# Altium project Iris.PrjPCB (part 1 of 2)
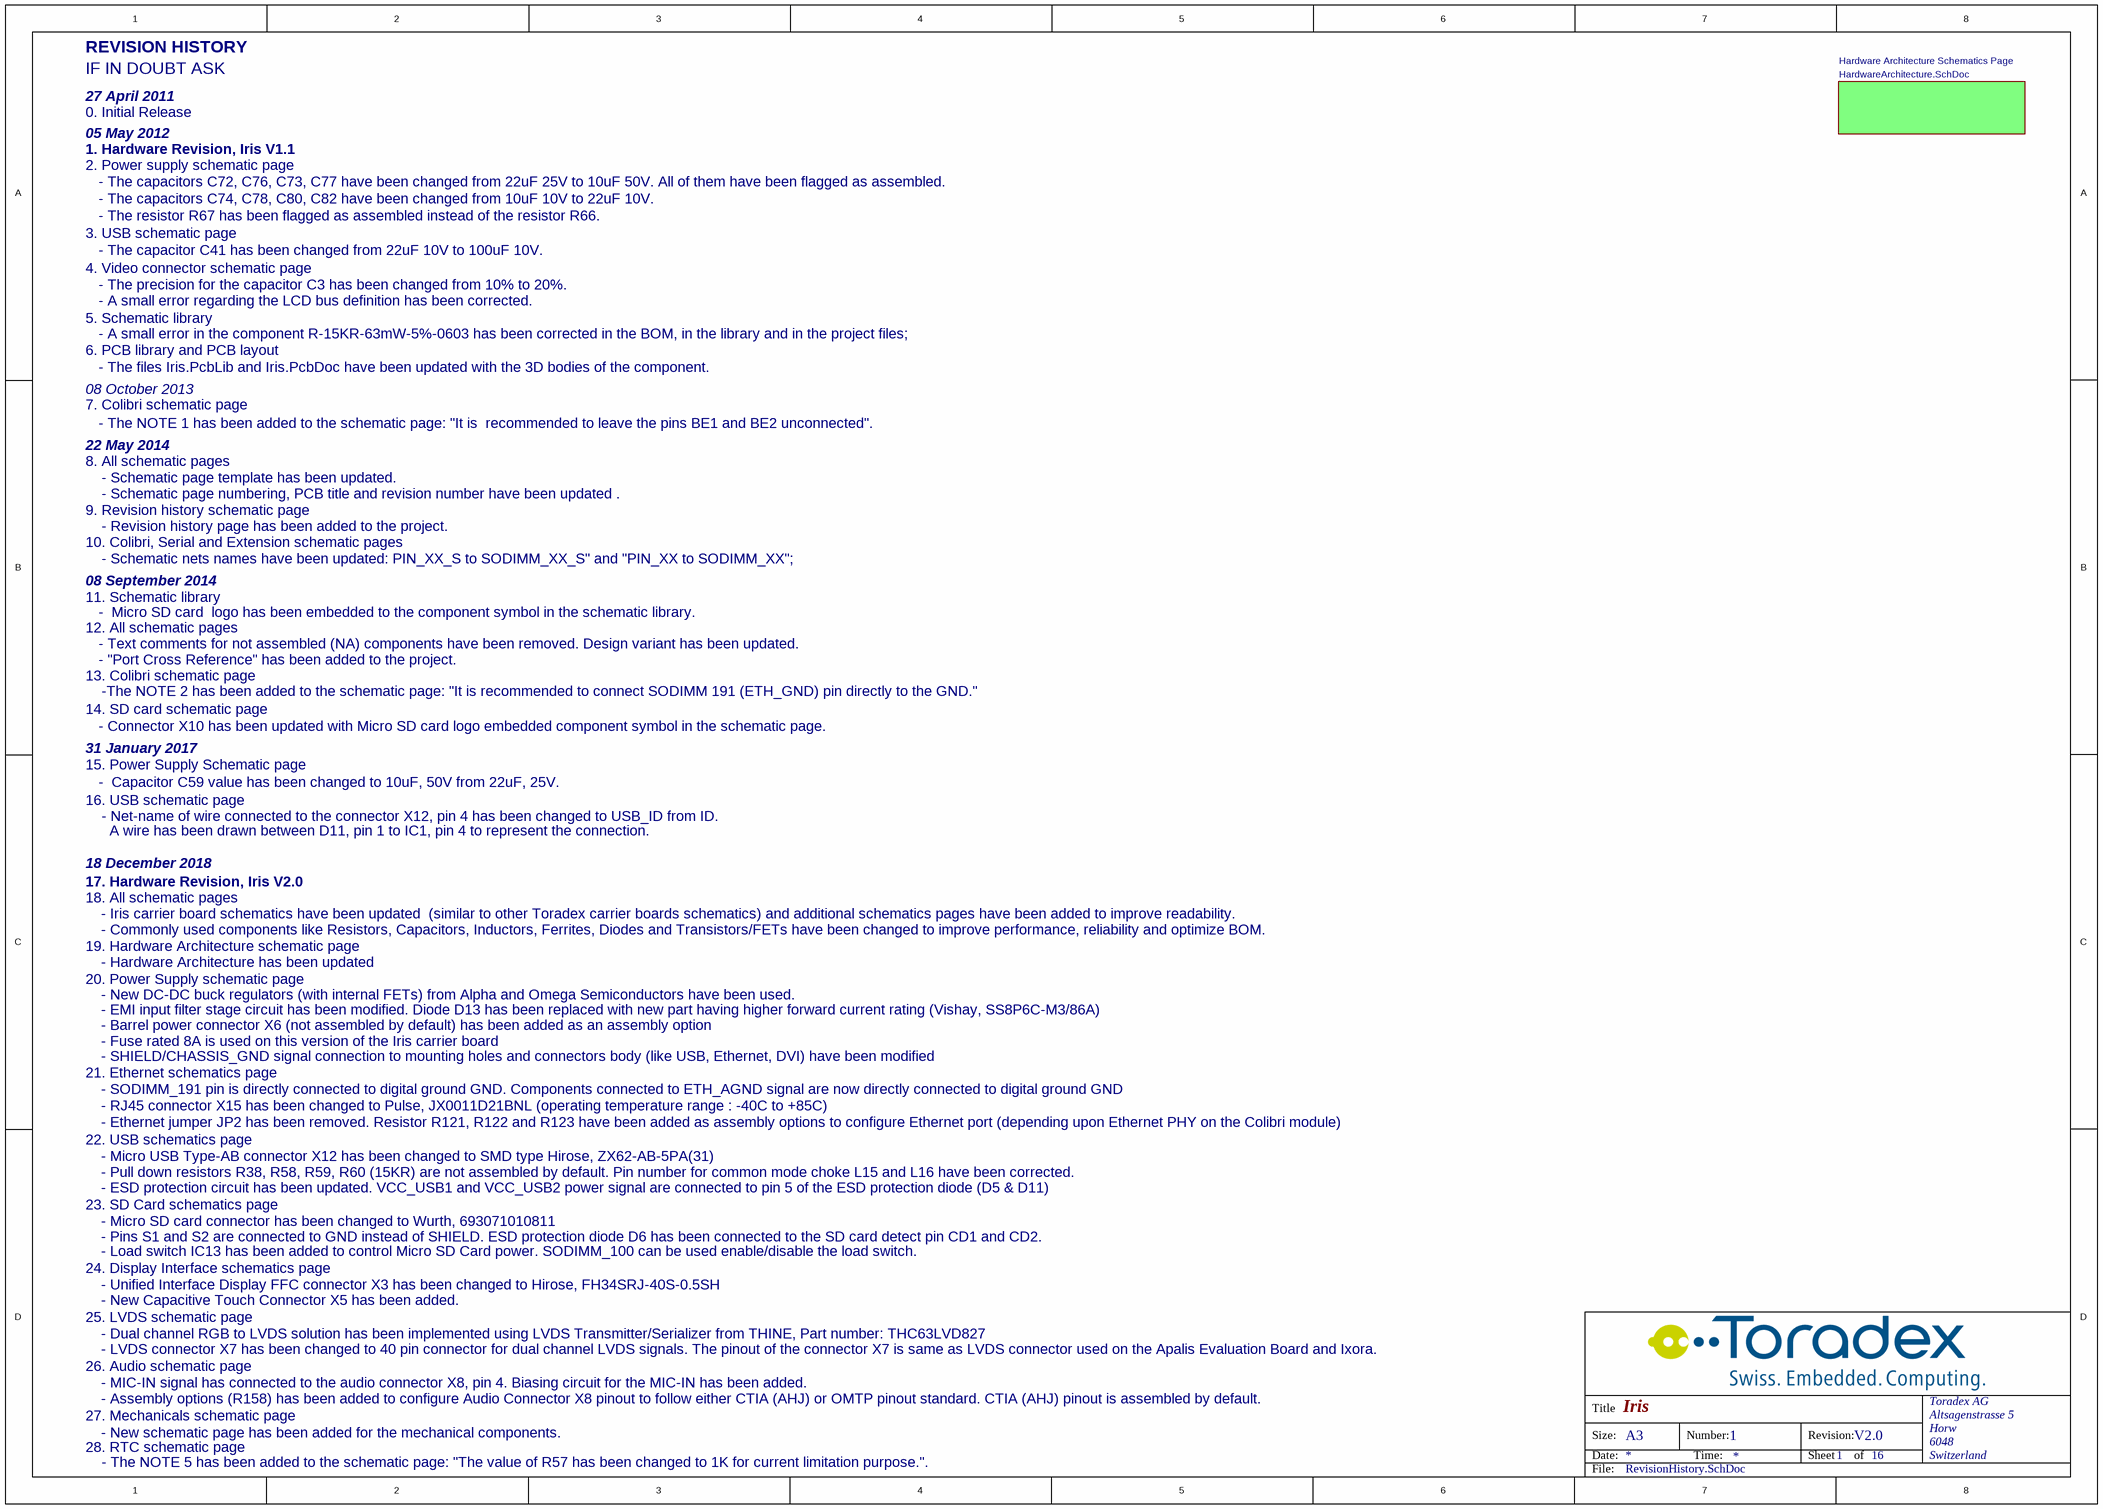
[diagram p0: RevisionHistory.SchDoc]
16 sheets, 400 parts. Net scope: global (net labels, ports and power ports of the same name join across sheets).
Board file: Iris.PcbDoc
Sheets:
  RevisionHistory.SchDoc
    Hardware Architecture Schematics Page = HardwareArchitecture.SchDoc
      Colibri Schematic Page = Colibri.SchDoc
      PowerSupply Schematic Page = PowerSupply.SchDoc
      Display Interface (RGB) Schematic Page = DisplayInterface.SchDoc
      Micro SDCard Schematic Page = SDCard.SchDoc
      Extension Schematic Page = Extension.SCHDOC
      Ethernet Schematic Page = Ethernet.SchDoc
      Audio Schematic Page = Audio.SchDoc
      USB Schematic Page = USB.SchDoc
      Serial Schematic Page = Serial.SchDoc
      External RTC Schematic Page = RTC.SchDoc
      Mechanical Components Schematic Page = Mechanicals.SchDoc
      DVI Schematic Page = DVI.SchDoc
      RGB-to-VGA (Video DAC) Schematic Page = RGB-to-VGA.SchDoc
      LVDS Schematic Page = LVDS.SchDoc

## Sheet RevisionHistory.SchDoc: Iris
size A3; Organization: Toradex AG; Address1: Altsagenstrasse 5; Address2: Horw; Address3: 6048; Address4: Switzerland; DocumentNumber: 1; Revision: V2.0; SheetNumber: 1; SheetTotal: 16

### Sub-sheets
Hardware Architecture Schematics Page = HardwareArchitecture.SchDoc: no entries

### Notes on the sheet
- REVISION HISTORY
- IF IN DOUBT ASK
- 27 April 2011
- 0. Initial Release
- 1. Hardware Revision, Iris V1.1
- 05 May 2012
- 2. Power supply schematic page
- 3. USB schematic page
- - The resistor R67 has been flagged as assembled instead of the resistor R66.
- - The capacitors C74, C78, C80, C82 have been changed from 10uF 10V to 22uF 10V.
- - The capacitors C72, C76, C73, C77 have been changed from 22uF 25V to 10uF 50V. All of them have been flagged as assembled.
- 4. Video connector schematic page
- - The capacitor C41 has been changed from 22uF 10V to 100uF 10V.
- - The precision for the capacitor C3 has been changed from 10% to 20%.
- - A small error regarding the LCD bus definition has been corrected.
- 5. Schematic library
- 6. PCB library and PCB layout
- - The files Iris.PcbLib and Iris.PcbDoc have been updated with the 3D bodies of the component.
- - A small error in the component R-15KR-63mW-5%-0603 has been corrected in the BOM, in the library and in the project files;
- 7. Colibri schematic page
- 08 October 2013
- 22 May 2014
- - The NOTE 1 has been added to the schematic page: "It is  recommended to leave the pins BE1 and BE2 unconnected".
- 8. All schematic pages
- 9. Revision history schematic page
- - Schematic page template has been updated.
- - Schematic page numbering, PCB title and revision number have been updated .
- 10. Colibri, Serial and Extension schematic pages
- 08 September 2014
- - Revision history page has been added to the project.
- - Schematic nets names have been updated: PIN_XX_S to SODIMM_XX_S" and "PIN_XX to SODIMM_XX";
- 12. All schematic pages
- 11. Schematic library
- - Text comments for not assembled (NA) components have been removed. Design variant has been updated.
- -  Micro SD card  logo has been embedded to the component symbol in the schematic library.
- 14. SD card schematic page
- 13. Colibri schematic page
- - "Port Cross Reference" has been added to the project.
- -The NOTE 2 has been added to the schematic page: "It is recommended to connect SODIMM 191 (ETH_GND) pin directly to the GND."
- 31 January 2017
- 15. Power Supply Schematic page
- - Connector X10 has been updated with Micro SD card logo embedded component symbol in the schematic page.
- -  Capacitor C59 value has been changed to 10uF, 50V from 22uF, 25V.
- 16. USB schematic page
- - Net-name of wire connected to the connector X12, pin 4 has been changed to USB_ID from ID.
- A wire has been drawn between D11, pin 1 to IC1, pin 4 to represent the connection.
- 17. Hardware Revision, Iris V2.0
- 18 December 2018
- 18. All schematic pages
- - Iris carrier board schematics have been updated  (similar to other Toradex carrier boards schematics) and additional schematics pages have been added to improve readability.
- 20. Power Supply schematic page
- 19. Hardware Architecture schematic page
- - Commonly used components like Resistors, Capacitors, Inductors, Ferrites, Diodes and Transistors/FETs have been changed to improve performance, reliability and optimize BOM.
- - Hardware Architecture has been updated
- - Fuse rated 8A is used on this version of the Iris carrier board
- - Barrel power connector X6 (not assembled by default) has been added as an assembly option
- - New DC-DC buck regulators (with internal FETs) from Alpha and Omega Semiconductors have been used.
- - EMI input filter stage circuit has been modified. Diode D13 has been replaced with new part having higher forward current rating (Vishay, SS8P6C-M3/86A)
- 21. Ethernet schematics page
- - SODIMM_191 pin is directly connected to digital ground GND. Components connected to ETH_AGND signal are now directly connected to digital ground GND
- - RJ45 connector X15 has been changed to Pulse, JX0011D21BNL (operating temperature range : -40C to +85C)
- - Ethernet jumper JP2 has been removed. Resistor R121, R122 and R123 have been added as assembly options to configure Ethernet port (depending upon Ethernet PHY on the Colibri module)
- - SHIELD/CHASSIS_GND signal connection to mounting holes and connectors body (like USB, Ethernet, DVI) have been modified
- 22. USB schematics page
- - Micro USB Type-AB connector X12 has been changed to SMD type Hirose, ZX62-AB-5PA(31)
- - Pull down resistors R38, R58, R59, R60 (15KR) are not assembled by default. Pin number for common mode choke L15 and L16 have been corrected.
- - ESD protection circuit has been updated. VCC_USB1 and VCC_USB2 power signal are connected to pin 5 of the ESD protection diode (D5 & D11)
- 23. SD Card schematics page
- - Micro SD card connector has been changed to Wurth, 693071010811
- - Pins S1 and S2 are connected to GND instead of SHIELD. ESD protection diode D6 has been connected to the SD card detect pin CD1 and CD2.
- - Load switch IC13 has been added to control Micro SD Card power. SODIMM_100 can be used enable/disable the load switch.
- 24. Display Interface schematics page
- 25. LVDS schematic page
- - Unified Interface Display FFC connector X3 has been changed to Hirose, FH34SRJ-40S-0.5SH
- - New Capacitive Touch Connector X5 has been added.
- 26. Audio schematic page
- - Dual channel RGB to LVDS solution has been implemented using LVDS Transmitter/Serializer from THINE, Part number: THC63LVD827
- - LVDS connector X7 has been changed to 40 pin connector for dual channel LVDS signals. The pinout of the connector X7 is same as LVDS connector used on the Apalis Evaluation Board and Ixora.
- - MIC-IN signal has connected to the audio connector X8, pin 4. Biasing circuit for the MIC-IN has been added.
- 27. Mechanicals schematic page
- 28. RTC schematic page
- - New schematic page has been added for the mechanical components.
- - Assembly options (R158) has been added to configure Audio Connector X8 pinout to follow either CTIA (AHJ) or OMTP pinout standard. CTIA (AHJ) pinout is assembled by default.
- - The NOTE 5 has been added to the schematic page: "The value of R57 has been changed to 1K for current limitation purpose.".
- Title
- Size:
- Date:
- A3
- Number:
- Time:
- Revision:
- Sheet
- of
- File:

## Sheet HardwareArchitecture.SchDoc: Iris
size A3; Organization: Toradex AG; Address1: Altsagenstrasse 5; Address2: Horw; Address3: 6048; Address4: Switzerland; DocumentNumber: 2; Revision: V2.0; SheetNumber: 2; SheetTotal: 16; PageSetup: Record=PageOptions|CenterHorizontal=True|CenterVertical=True|PrintScale=0.73|XCorrection=1.00|YCorrection=1.00|PrintKind=0|BorderSize=5000000|LeftOffset=0|BottomOffset=0|Orientation=2|PaperLength=1000|PaperWidth=1000|Scale=100|PaperSource=7|PrintQuality=600|MediaType=1|DitherType=10|PaperKind=A4|PrintScaleMode=1
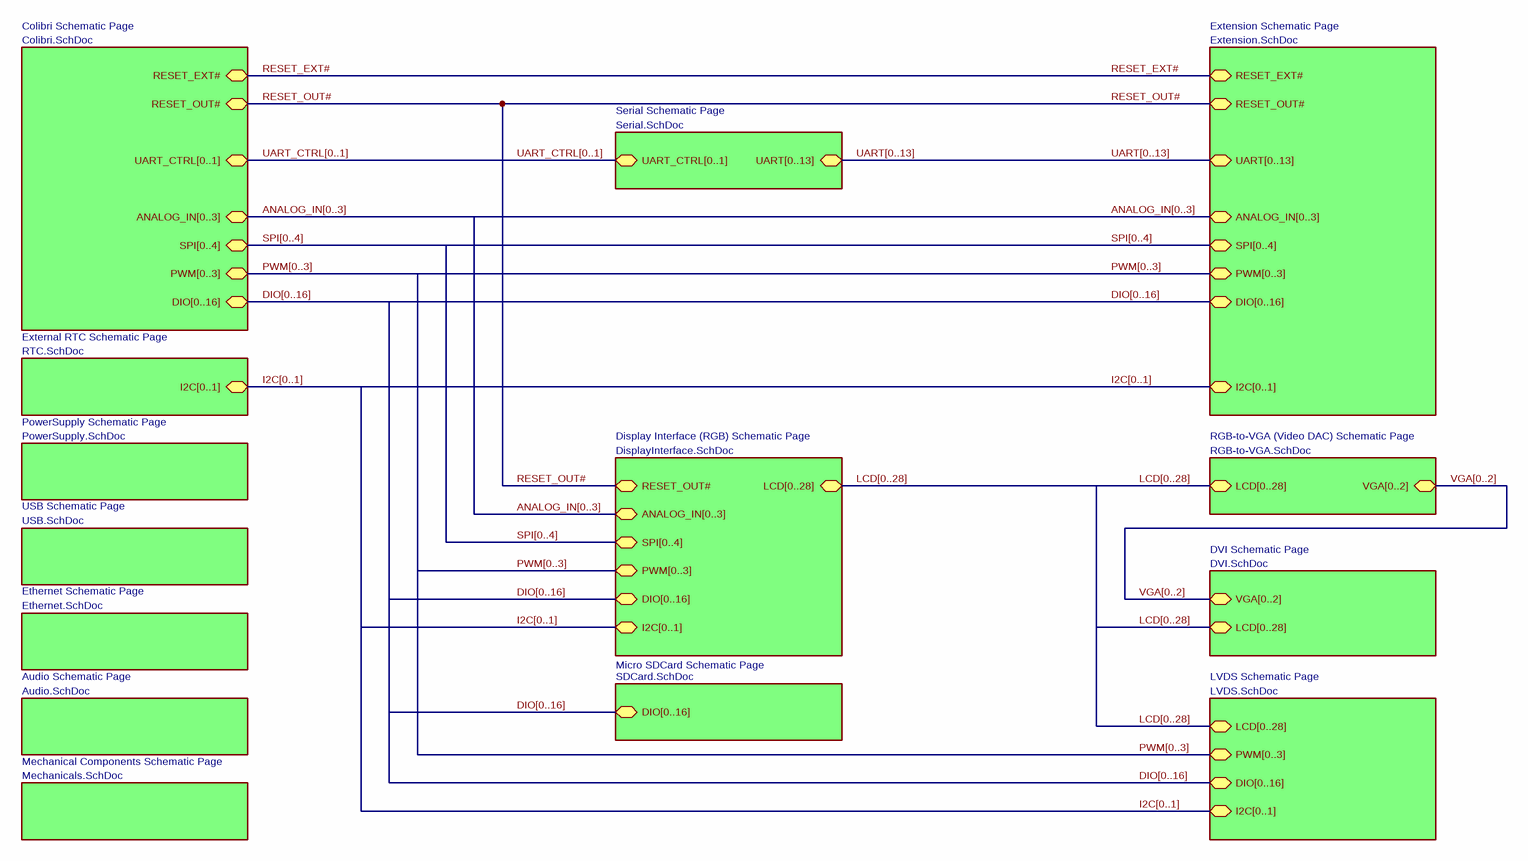
[diagram p1: HardwareArchitecture.SchDoc]

### Sub-sheets
Audio Schematic Page = Audio.SchDoc: no entries
Colibri Schematic Page = Colibri.SchDoc: ANALOG_IN[0..3] (bidir), DIO[0..16] (bidir), SPI[0..4] (bidir), UART_CTRL[0..1] (bidir), RESET_OUT# (bidir), PWM[0..3] (bidir), RESET_EXT# (bidir)
Display Interface (RGB) Schematic Page = DisplayInterface.SchDoc: I2C[0..1] (bidir), LCD[0..28] (bidir), SPI[0..4] (bidir), PWM[0..3] (bidir), ANALOG_IN[0..3] (bidir), DIO[0..16] (bidir), RESET_OUT# (bidir)
DVI Schematic Page = DVI.SchDoc: VGA[0..2] (bidir), LCD[0..28] (bidir)
Ethernet Schematic Page = Ethernet.SchDoc: no entries
Extension Schematic Page = Extension.SchDoc: DIO[0..16] (bidir), I2C[0..1] (bidir), PWM[0..3] (bidir), ANALOG_IN[0..3] (bidir), SPI[0..4] (bidir), UART[0..13] (bidir), RESET_EXT# (bidir), RESET_OUT# (bidir)
External RTC Schematic Page = RTC.SchDoc: I2C[0..1] (bidir)
LVDS Schematic Page = LVDS.SchDoc: LCD[0..28] (bidir), DIO[0..16] (bidir), PWM[0..3] (bidir), I2C[0..1] (bidir)
Mechanical Components Schematic Page = Mechanicals.SchDoc: no entries
Micro SDCard Schematic Page = SDCard.SchDoc: DIO[0..16] (bidir)
PowerSupply Schematic Page = PowerSupply.SchDoc: no entries
RGB-to-VGA (Video DAC) Schematic Page = RGB-to-VGA.SchDoc: LCD[0..28] (bidir), VGA[0..2] (bidir)
Serial Schematic Page = Serial.SchDoc: UART[0..13] (bidir), UART_CTRL[0..1] (bidir)
USB Schematic Page = USB.SchDoc: no entries

### Nets
RESET_EXT#: sheet Colibri Schematic Page/RESET_EXT#, sheet Extension Schematic Page/RESET_EXT#
RESET_OUT#: sheet Colibri Schematic Page/RESET_OUT#, sheet Display Interface (RGB) Schematic Page/RESET_OUT#, sheet Extension Schematic Page/RESET_OUT#

### Buses and harness runs
bus ANALOG_IN[0..3] = sheet Colibri Schematic Page/ANALOG_IN[0..3] = sheet Display Interface (RGB) Schematic Page/ANALOG_IN[0..3] = sheet Extension Schematic Page/ANALOG_IN[0..3]
bus DIO[0..16] = sheet Colibri Schematic Page/DIO[0..16] = sheet Display Interface (RGB) Schematic Page/DIO[0..16] = sheet Extension Schematic Page/DIO[0..16] = sheet LVDS Schematic Page/DIO[0..16] = sheet Micro SDCard Schematic Page/DIO[0..16]
bus I2C[0..1] = sheet Display Interface (RGB) Schematic Page/I2C[0..1] = sheet Extension Schematic Page/I2C[0..1] = sheet External RTC Schematic Page/I2C[0..1] = sheet LVDS Schematic Page/I2C[0..1]
bus LCD[0..28] = sheet Display Interface (RGB) Schematic Page/LCD[0..28] = sheet DVI Schematic Page/LCD[0..28] = sheet LVDS Schematic Page/LCD[0..28] = sheet RGB-to-VGA (Video DAC) Schematic Page/LCD[0..28]
bus PWM[0..3] = sheet Colibri Schematic Page/PWM[0..3] = sheet Display Interface (RGB) Schematic Page/PWM[0..3] = sheet Extension Schematic Page/PWM[0..3] = sheet LVDS Schematic Page/PWM[0..3]
bus SPI[0..4] = sheet Colibri Schematic Page/SPI[0..4] = sheet Display Interface (RGB) Schematic Page/SPI[0..4] = sheet Extension Schematic Page/SPI[0..4]
bus UART[0..13] = sheet Extension Schematic Page/UART[0..13] = sheet Serial Schematic Page/UART[0..13]
bus UART_CTRL[0..1] = sheet Colibri Schematic Page/UART_CTRL[0..1] = sheet Serial Schematic Page/UART_CTRL[0..1]
bus VGA[0..2] = sheet DVI Schematic Page/VGA[0..2] = sheet RGB-to-VGA (Video DAC) Schematic Page/VGA[0..2]

### Notes on the sheet
- Title
- Size:
- Date:
- A3
- Number:
- Time:
- Revision:
- Sheet
- of
- File:

## Sheet Colibri.SchDoc: Iris
size A3; Organization: Toradex AG; Address1: Altsagenstrasse 5; Address2: Horw; Address3: 6048; Address4: Switzerland; DocumentNumber: 4; Revision: V2.0; SheetNumber: 4; SheetTotal: 16
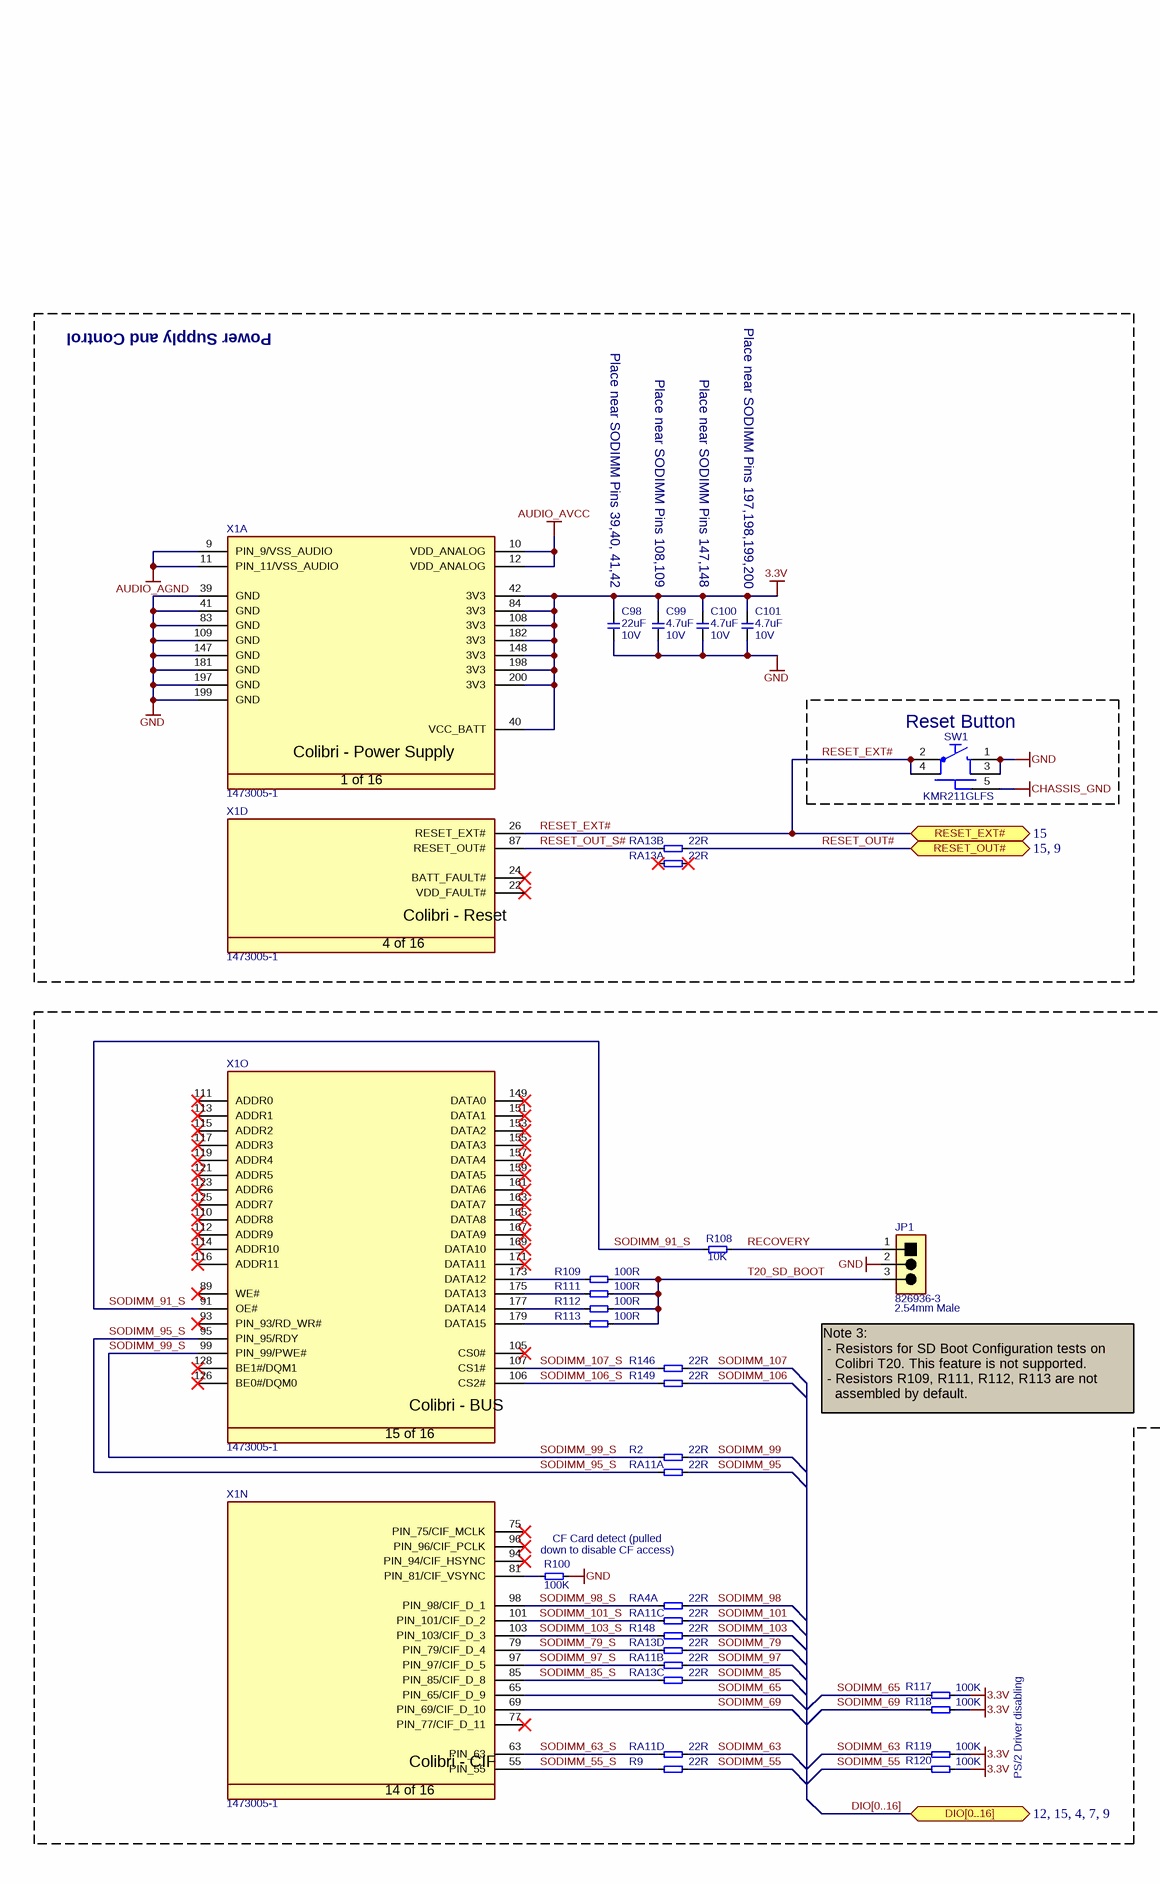
[diagram p2: Colibri.SchDoc, left]
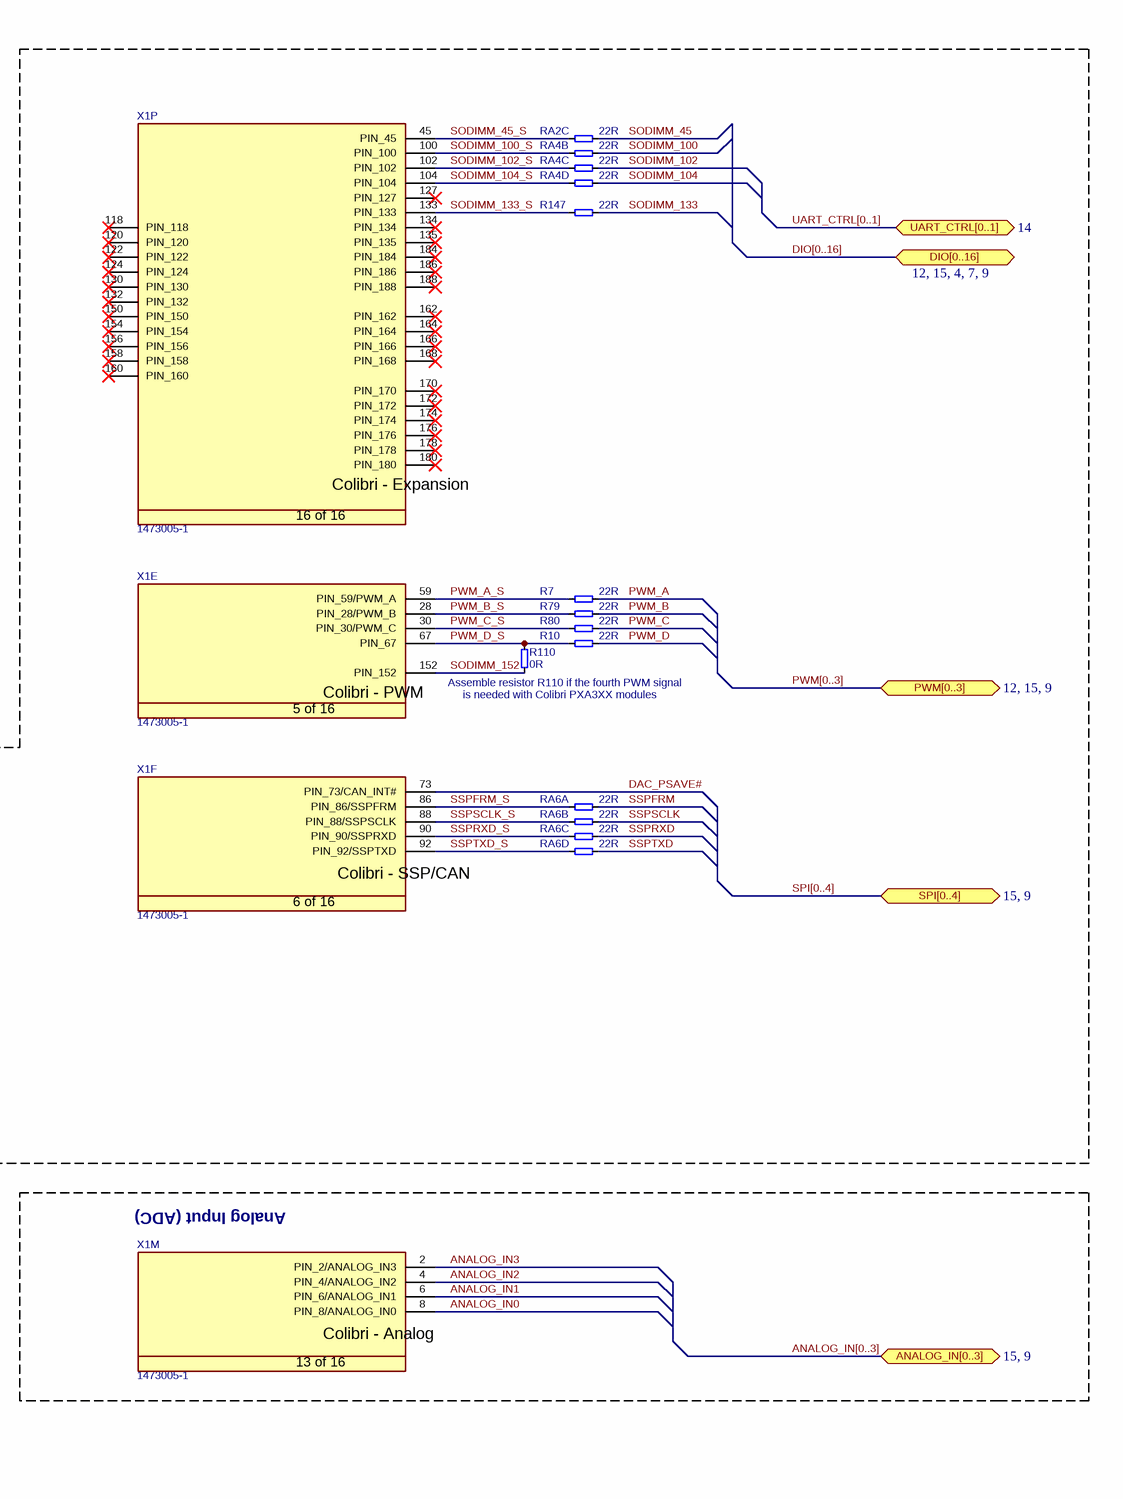
[diagram p3: Colibri.SchDoc, right]

### Parts
C98  Rating: 10V  [T_CAPC0805X125N]  (hidden comment: 22uF)
C99  Rating: 10V  [T_CAPC0603X33N]  (hidden comment: 4.7uF)
C100  Rating: 10V  [T_CAPC0603X33N]  (hidden comment: 4.7uF)
C101  Rating: 10V  [T_CAPC0603X33N]  (hidden comment: 4.7uF)
JP1  826936-3  [T_TYCO_826936-3]
R2  22R  [RESC1005X40N]
R7  22R  [RESC1005X40N]
R9  22R  [RESC1005X40N]
R10  22R  [RESC1005X40N]
R79  22R  [RESC1005X40N]
R80  22R  [RESC1005X40N]
R100  100K  [RESC1005X40N]
R108  10K  [RESC1005X40N]
R109  100R  [T_RESC0603X30N]
R110  0R  [T_RESC0603X30N]
R111  100R  [T_RESC0603X30N]
R112  100R  [T_RESC0603X30N]
R113  100R  [T_RESC0603X30N]
R117  100K  [RESC1005X40N]
R118  100K  [RESC1005X40N]
R119  100K  [RESC1005X40N]
R120  100K  [RESC1005X40N]
R146  22R  [RESC1005X40N]
R147  22R  [RESC1005X40N]
R148  22R  [RESC1005X40N]
R149  22R  [RESC1005X40N]
RA2  22R  [T_Resistor_Array_X4]  (part C of 4)
RA4  22R  [T_Resistor_Array_X4]  (parts A,B,C,D of 4)
RA6  22R  [T_Resistor_Array_X4]  (parts A,B,C,D of 4)
RA11  22R  [T_Resistor_Array_X4]  (parts A,B,C,D of 4)
RA13  22R  [T_Resistor_Array_X4]  (parts A,B,C,D of 4)
SW1  KMR211GLFS  [T_CnK_KMR211GLFS]
X1  1473005-1  [T_Tyco_1473005-1]  (parts A,D,E,F,M,N,O,P of 16)

### Blocks framed on the sheet
Power Supply and Control: C98-C101 RA13 X1
Reset Button: SW1
Analog Input (ADC): X1

### Ports
ANALOG_IN[0..3] (bidir, see 15, 9), DIO[0..16] (bidir, see 12, 15, 4, 7, 9), PWM[0..3] (bidir, see 12, 15, 9), RESET_EXT# (bidir, see 15), RESET_OUT# (bidir, see 15, 9), SPI[0..4] (bidir, see 15, 9), UART_CTRL[0..1] (bidir, see 14)

### Nets
3.3V: C98.2 C99.1 C100.1 C101.1 R117.1 R118.1 R119.1 R120.1 X1.40(VCC_BATT) X1.42(3V3) X1.84(3V3) X1.108(3V3) X1.148(3V3) X1.182(3V3) X1.198(3V3) X1.200(3V3)
AUDIO_AGND: X1.9(PIN_9/VSS_AUDIO) X1.11(PIN_11/VSS_AUDIO)
AUDIO_AVCC: X1.10(VDD_ANALOG) X1.12(VDD_ANALOG)
CHASSIS_GND: SW1.5
GND: C98.1 C99.2 C100.2 C101.2 JP1.2 R100.1 SW1.1 SW1.3 X1.39(GND) X1.41(GND) X1.83(GND) X1.109(GND) X1.147(GND) X1.181(GND) X1.197(GND) X1.199(GND)
ANALOG_IN0: X1.8(PIN_8/ANALOG_IN0)
ANALOG_IN1: X1.6(PIN_6/ANALOG_IN1)
ANALOG_IN2: X1.4(PIN_4/ANALOG_IN2)
ANALOG_IN3: X1.2(PIN_2/ANALOG_IN3)
DAC_PSAVE#: X1.73(PIN_73/CAN_INT#)
PWM_A: R7.2
PWM_A_S: R7.1 X1.59(PIN_59/PWM_A)
PWM_B: R79.2
PWM_B_S: R79.1 X1.28(PIN_28/PWM_B)
PWM_C: R80.2
PWM_C_S: R80.1 X1.30(PIN_30/PWM_C)
PWM_D: R10.2
PWM_D_S: R10.1 R110.1 X1.67(PIN_67)
RECOVERY: JP1.1 R108.2
RESET_EXT#: SW1.2 SW1.4 X1.26(RESET_EXT#) ; port RESET_EXT#
RESET_OUT#: RA13.6 ; port RESET_OUT#
RESET_OUT_S#: RA13.2 X1.87(RESET_OUT#)
SODIMM_45: RA2.7
SODIMM_45_S: RA2.3 X1.45(PIN_45)
SODIMM_55: R9.2 R120.2
SODIMM_55_S: R9.1 X1.55(PIN_55)
SODIMM_63: R119.2 RA11.8
SODIMM_63_S: RA11.4 X1.63(PIN_63)
SODIMM_65: R117.2 X1.65(PIN_65/CIF_D_9)
SODIMM_69: R118.2 X1.69(PIN_69/CIF_D_10)
SODIMM_79: RA13.8
SODIMM_79_S: RA13.4 X1.79(PIN_79/CIF_D_4)
SODIMM_85: RA13.7
SODIMM_85_S: RA13.3 X1.85(PIN_85/CIF_D_8)
SODIMM_91_S: R108.1 X1.91(OE#)
SODIMM_95: RA11.5
SODIMM_95_S: RA11.1 X1.95(PIN_95/RDY)
SODIMM_97: RA11.6
SODIMM_97_S: RA11.2 X1.97(PIN_97/CIF_D_5)
SODIMM_98: RA4.5
SODIMM_98_S: RA4.1 X1.98(PIN_98/CIF_D_1)
SODIMM_99: R2.2
SODIMM_99_S: R2.1 X1.99(PIN_99/PWE#)
SODIMM_100: RA4.6
SODIMM_100_S: RA4.2 X1.100(PIN_100)
SODIMM_101: RA11.7
SODIMM_101_S: RA11.3 X1.101(PIN_101/CIF_D_2)
SODIMM_102: RA4.7
SODIMM_102_S: RA4.3 X1.102(PIN_102)
SODIMM_103: R148.2
SODIMM_103_S: R148.1 X1.103(PIN_103/CIF_D_3)
SODIMM_104: RA4.8
SODIMM_104_S: RA4.4 X1.104(PIN_104)
SODIMM_106: R149.2
SODIMM_106_S: R149.1 X1.106(CS2#)
SODIMM_107: R146.2
SODIMM_107_S: R146.1 X1.107(CS1#)
SODIMM_133: R147.2
SODIMM_133_S: R147.1 X1.133(PIN_133)
SODIMM_152: R110.2 X1.152(PIN_152)
SSPFRM: RA6.5
SSPFRM_S: RA6.1 X1.86(PIN_86/SSPFRM)
SSPRXD: RA6.7
SSPRXD_S: RA6.3 X1.90(PIN_90/SSPRXD)
SSPSCLK: RA6.6
SSPSCLK_S: RA6.2 X1.88(PIN_88/SSPSCLK)
SSPTXD: RA6.8
SSPTXD_S: RA6.4 X1.92(PIN_92/SSPTXD)
T20_SD_BOOT: JP1.3 R109.1 R111.1 R112.1 R113.1
NetR100_2: R100.2 X1.81(PIN_81/CIF_VSYNC)
NetR109_2: R109.2 X1.173(DATA12)
NetR111_2: R111.2 X1.175(DATA13)
NetR112_2: R112.2 X1.177(DATA14)
NetR113_2: R113.2 X1.179(DATA15)

Not connected (* = marked no-connect by the designer): RA13 1* 5*; X1 22(VDD_FAULT#)* 24(BATT_FAULT#)* 75(PIN_75/CIF_MCLK)* 77(PIN_77/CIF_D_11)* 89(WE#)* 93(PIN_93/RD_WR#)* 94(PIN_94/CIF_HSYNC)* 96(PIN_96/CIF_PCLK)* 105(CS0#)* 110(ADDR8)* 111(ADDR0)* 112(ADDR9)* 113(ADDR1)* 114(ADDR10)* 115(ADDR2)* 116(ADDR11)* 117(ADDR3)* 118(PIN_118)* 119(ADDR4)* 120(PIN_120)* 121(ADDR5)* 122(PIN_122)* 123(ADDR6)* 124(PIN_124)* 125(ADDR7)* 126(BE0#/DQM0)* 127(PIN_127)* 128(BE1#/DQM1)* 130(PIN_130)* 132(PIN_132)* 134(PIN_134)* 135(PIN_135)* 149(DATA0)* 150(PIN_150)* 151(DATA1)* 153(DATA2)* 154(PIN_154)* 155(DATA3)* 156(PIN_156)* 157(DATA4)* 158(PIN_158)* 159(DATA5)* 160(PIN_160)* 161(DATA6)* 162(PIN_162)* 163(DATA7)* 164(PIN_164)* 165(DATA8)* 166(PIN_166)* 167(DATA9)* 168(PIN_168)* 169(DATA10)* 170(PIN_170)* 171(DATA11)* 172(PIN_172)* 174(PIN_174)* 176(PIN_176)* 178(PIN_178)* 180(PIN_180)* 184(PIN_184)* 186(PIN_186)* 188(PIN_188)*

### Buses and harness runs
bus ANALOG_IN[0..3] = port ANALOG_IN[0..3]
bus DIO[0..16] = port DIO[0..16]
bus PWM[0..3] = port PWM[0..3]
bus SPI[0..4] = port SPI[0..4]
bus UART_CTRL[0..1] = port UART_CTRL[0..1]

### Notes on the sheet
- Place near SODIMM Pins 39,40, 41,42
- Place near SODIMM Pins 197,198,199,200
- Place near SODIMM Pins 108,109
- Place near SODIMM Pins 147,148
- (near R110) Assemble resistor R110 if the fourth PWM signal
- (near R110) is needed with Colibri PXA3XX modules
- (near JP1) 2.54mm Male
- (near JP1) Note 3:
  - Resistors for SD Boot Configuration tests on
  Colibri T20. This feature is not supported.
  - Resistors R109, R111, R112, R113 are not
  assembled by default.
- (near R100) down to disable CF access)
- (near R100) CF Card detect (pulled
- PS/2 Driver disabling
- Title
- Size:
- Date:
- A3
- Number:
- Time:
- Revision:
- Sheet
- of
- File:
- (in symbol CON-Tyco-1473005-1-200-0.6mm, part A) Colibri - Power Supply; 1 of 16
- (in symbol CON-Tyco-1473005-1-200-0.6mm, part D) Colibri - Reset; 4 of 16
- (in symbol CON-Tyco-1473005-1-200-0.6mm, part E) Colibri - PWM; 5 of 16
- (in symbol CON-Tyco-1473005-1-200-0.6mm, part F) Colibri - SSP/CAN; 6 of 16
- (in symbol CON-Tyco-1473005-1-200-0.6mm, part M) Colibri - Analog; 13 of 16
- (in symbol CON-Tyco-1473005-1-200-0.6mm, part N) Colibri - CIF; 14 of 16
- (in symbol CON-Tyco-1473005-1-200-0.6mm, part O) Colibri - BUS; 15 of 16
- (in symbol CON-Tyco-1473005-1-200-0.6mm, part P) Colibri - Expansion; 16 of 16

### Library data of the parts
C98 = C-X5R-22uF-10V-20%-0805: Capacitor Ceramic X5R 22uF 10V 20% 0805; Tolerance: 20%; Type: X5R; Value: 22uF
C99-C101 = C-X5R-4.7uF-10V-10%-0603: Capacitor Ceramic X5R 4.7uF 10V 10% 0603; Manufacturer Name: Generic; Tolerance: 10%; Type: X5R; Value: 4.7uF; Manufacturer Part No.: *
JP1 = CON-Tyco-826936-3-1X3-2.54mm-JP: Jumper, 3-Pin; Manufacturer Name: Tyco; No. of ways: 1X3; Pitch: 2.54mm; Manufacturer Part No.: 826936-3
R2 R7 R9 R10 R79 R80 R146-R149 = R-22R-63mW-5%-0402: Resistor 22 ohm 63mW 5% 0402; Rating: 63mW; Tolerance: 5%; Value: 22R
R100 R117-R120 = R-100KR-63mW-5%-0402: Resistor 100 Kohm 63mW 5% 0402; Value: 100KR; Rating: 63mW; Tolerance: 5%
R108 = R-10KR-63mW-1%-0402: Resistor 10 Kohm 63mW 1% 0402; Value: 10KR; Rating: 63mW; Tolerance: 1%
R109 R111-R113 = R-100R-63mW-5%-0603: Resistor 100 ohm 63mW 5% 0603; Rating: 63mW; Tolerance: 5%; Value: 100R
R110 = R-0R-63mW-5%-0603: Resistor 0 ohm 63mW 5% 0603; Rating: 63mW; Tolerance: 5%; Value: 0R; Size: 0603 (In)
RA2 RA4 RA6 RA11 RA13 = RA-22R-63mW-5%-1206-div: Resistor Array 22 R 63mW 5% 1206; Manufacturer Name: Generic; Tolerance: 5%; Power Dissipation: 63mW; Manufacturer Part Number: *; Value: 22R
SW1 = SW_CnK-KMR211GLFS-1VA: Power ON Switch; Manufacturer Name: C&N; Rating: 1VA; Manufacturer Part No.: KMR211GLFS
X1 = CON-Tyco-1473005-1-200-0.6mm: SODIMM Connector; Manufacturer Name: Tyco; No. of ways: 200; Manufacturer Part No.: 1473005-1

## Sheet PowerSupply.SchDoc: Iris
size A3; Organization: Toradex AG; Address1: Altsagenstrasse 5; Address2: Horw; Address3: 6048; Address4: Switzerland; DocumentNumber: 3; Revision: V2.0; SheetNumber: 3; SheetTotal: 16
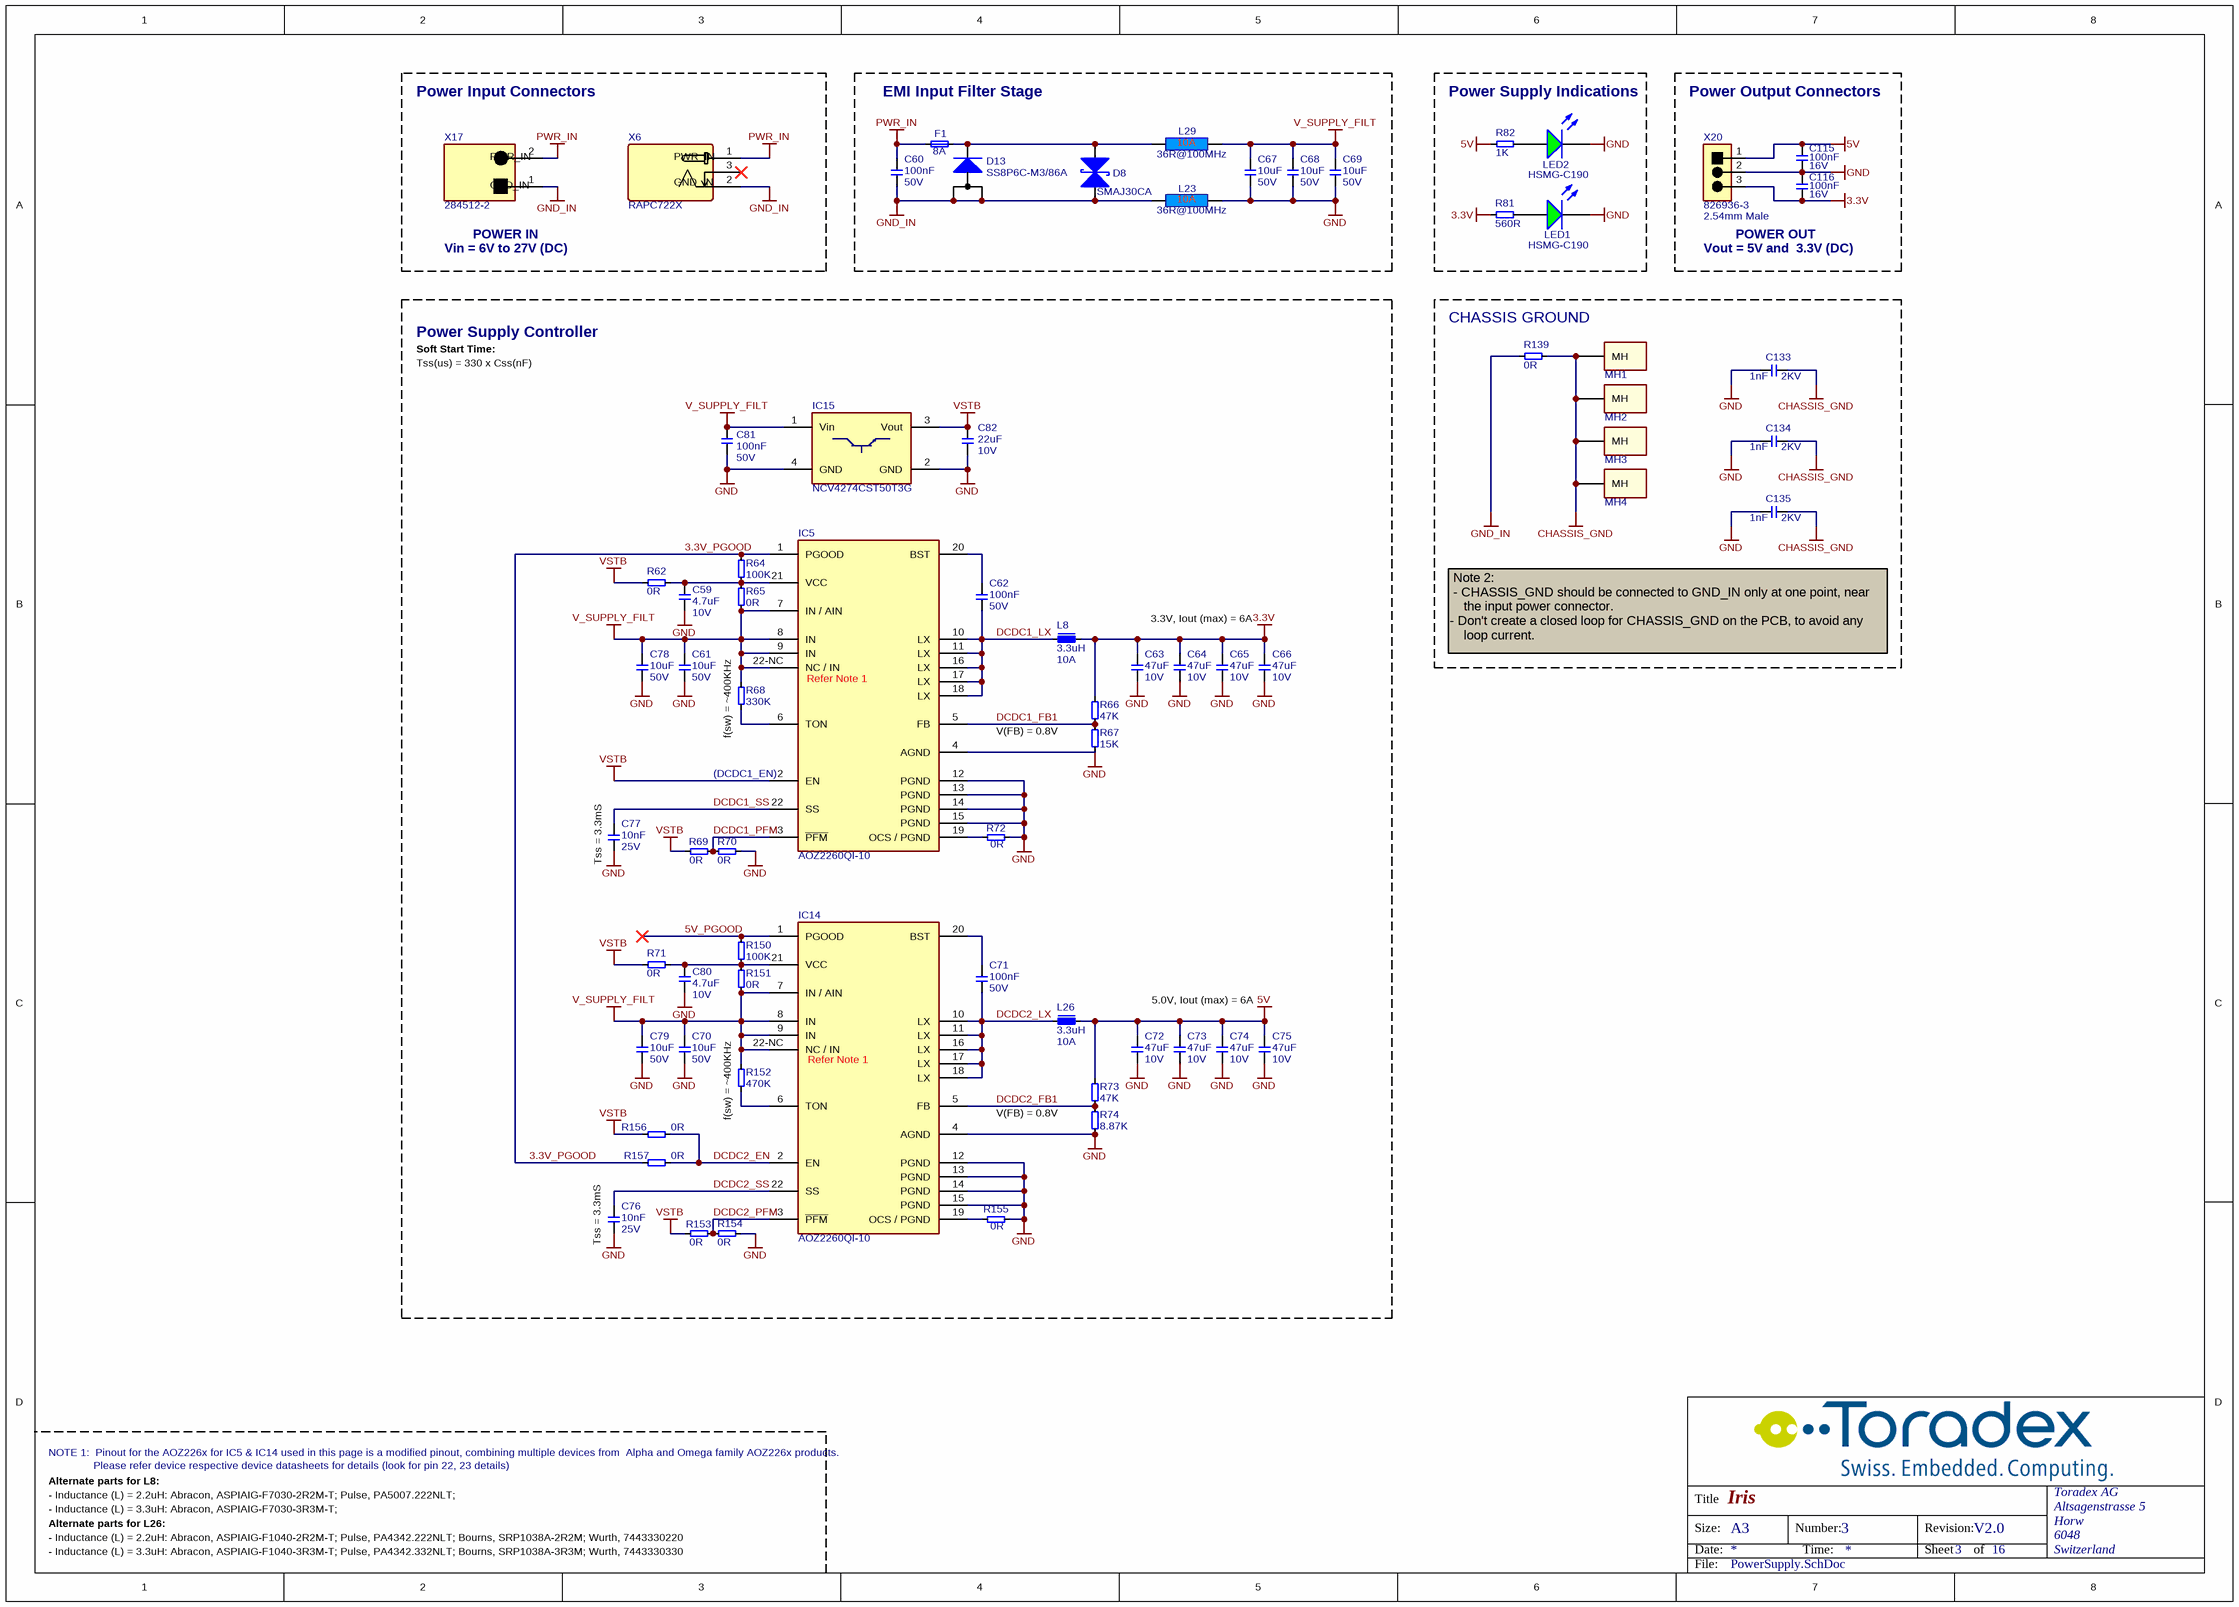
[diagram p4: PowerSupply.SchDoc]

### Parts
C59  Rating: 10V  [T_CAPC0603X33N]  (hidden comment: 4.7uF)
C60  Rating: 50V  [T_CAPC0603X33N]  (hidden comment: 100nF)
C61  Rating: 50V  [CAPC3225X160N]  (hidden comment: 10uF)
C62  Rating: 50V  [T_CAPC0603X33N]  (hidden comment: 100nF)
C63  Rating: 10V  [T_CAPC0805X125N]  (hidden comment: 47uF)
C64  Rating: 10V  [T_CAPC0805X125N]  (hidden comment: 47uF)
C65  Rating: 10V  [T_CAPC0805X125N]  (hidden comment: 47uF)
C66  Rating: 10V  [T_CAPC0805X125N]  (hidden comment: 47uF)
C67  Rating: 50V  [CAPC3225X160N]  (hidden comment: 10uF)
C68  Rating: 50V  [CAPC3225X160N]  (hidden comment: 10uF)
C69  Rating: 50V  [CAPC3225X160N]  (hidden comment: 10uF)
C70  Rating: 50V  [CAPC3225X160N]  (hidden comment: 10uF)
C71  Rating: 50V  [T_CAPC0603X33N]  (hidden comment: 100nF)
C72  Rating: 10V  [T_CAPC0805X125N]  (hidden comment: 47uF)
C73  Rating: 10V  [T_CAPC0805X125N]  (hidden comment: 47uF)
C74  Rating: 10V  [T_CAPC0805X125N]  (hidden comment: 47uF)
C75  Rating: 10V  [T_CAPC0805X125N]  (hidden comment: 47uF)
C76  Rating: 25V  [CAPC1005X60N]  (hidden comment: 10nF)
C77  Rating: 25V  [CAPC1005X60N]  (hidden comment: 10nF)
C78  Rating: 50V  [CAPC3225X160N]  (hidden comment: 10uF)
C79  Rating: 50V  [CAPC3225X160N]  (hidden comment: 10uF)
C80  Rating: 10V  [T_CAPC0603X33N]  (hidden comment: 4.7uF)
C81  Rating: 50V  [T_CAPC0603X33N]  (hidden comment: 100nF)
C82  Rating: 10V  [T_CAPC0805X125N]  (hidden comment: 22uF)
C115  Rating: 16V  [CAPC1005X60N]  (hidden comment: 100nF)
C116  Rating: 16V  [CAPC1005X60N]  (hidden comment: 100nF)
C133  Rating: 2KV  [T_CAPC1206X180N]  (hidden comment: 1nF)
C134  Rating: 2KV  [T_CAPC1206X180N]  (hidden comment: 1nF)
C135  Rating: 2KV  [T_CAPC1206X180N]  (hidden comment: 1nF)
D8  Manufacturer Part No.: SMAJ30CA  [T_LITTLEFUSE_SMAJ30CA]  (hidden comment: D-Littelfuse-SMAJ30CA-Schottky)
D13  SS8P6C-M3/86A  [T_DIOM_TO277A]
F1  8A  [T_Littelfuse_0458]
IC5  AOZ2260QI-10  [T_QFN50P400X400X100-23N (AOZ226x) - PIN22-NC_NOPASTE]
IC14  AOZ2260QI-10  [T_QFN50P400X400X100-23N (AOZ226x) - PIN22-NC_NOPASTE]
IC15  NCV4274CST50T3G  [T_ON_NCV4264-2ST50T3G]
L8  Rating: 10A  [T_INDM780760]  (hidden comment: 3.3uH)
L23  36R@100MHz  [T_Laird_35F0121-0SR-10]
L26  Rating: 10A  [T_INDM110100]  (hidden comment: 3.3uH)
L29  36R@100MHz  [T_Laird_35F0121-0SR-10]
LED1  Manufacturer Part No.: HSMG-C190  [LEDC1608X80N]  (hidden comment: LED)
LED2  Manufacturer Part No.: HSMG-C190  [LEDC1608X80N]  (hidden comment: LED)
MH1  MECH-MountingHoles  [T_MountingHoles]  (value not drawn)  (no BOM)
MH2  MECH-MountingHoles  [T_MountingHoles]  (value not drawn)  (no BOM)
MH3  MECH-MountingHoles  [T_MountingHoles]  (value not drawn)  (no BOM)
MH4  MECH-MountingHoles  [T_MountingHoles]  (value not drawn)  (no BOM)
R62  0R  [T_RESC0603X30N]
R64  100K  [RESC1005X40N]
R65  0R  [T_RESC0603X30N]
R66  47K  [RESC1005X40N]
R67  15K  [RESC1005X40N]
R68  330K  [RESC1005X40N]
R69  0R  [T_RESC0603X30N]
R70  0R  [T_RESC0603X30N]
R71  0R  [T_RESC0603X30N]
R72  0R  [T_RESC0603X30N]
R73  47K  [RESC1005X40N]
R74  8.87K  [RESC1005X40N]
R81  560R  [RESC1005X40N]
R82  1K  [RESC1005X40N]
R139  0R  [T_RESC3216X760N]
R150  100K  [RESC1005X40N]
R151  0R  [T_RESC0603X30N]
R152  470K  [RESC1005X40N]
R153  0R  [T_RESC0603X30N]
R154  0R  [T_RESC0603X30N]
R155  0R  [T_RESC0603X30N]
R156  0R  [T_RESC0603X30N]
R157  0R  [T_RESC0603X30N]
X6  RAPC722X  [T_RAPC722X]
X17  284512-2  [T_TYCO_284512-2]
X20  826936-3  [T_TYCO_826936-3]

### Blocks framed on the sheet
Power Input Connectors: X6 X17
EMI Input Filter Stage: C60 C67-C69 D8 D13 F1 L23 L29
Power Supply Indications: LED1 LED2 R81 R82
Power Output Connectors: C115 C116 X20
Power Supply Controller: C59 C61-C66 C70-C82 IC5 IC14 IC15 L8 L26 R62 R64-R74 R150-R157
CHASSIS GROUND: C133-C135 MH1-MH4 R139

### Nets
3.3V: C63.2 C64.2 C65.2 C66.2 C116.1 L8.2 R66.2 R81.2 X20.3
5V: C72.2 C73.2 C74.2 C75.2 C115.2 L26.2 R73.2 R82.2 X20.1
CHASSIS_GND: C133.1 C134.1 C135.1 MH1.1(MH) MH2.1(MH) MH3.1(MH) MH4.1(MH) R139.2
GND: C59.1 C61.1 C63.1 C64.1 C65.1 C66.1 C67.1 C68.1 C69.1 C70.1 C72.1 C73.1 C74.1 C75.1 C76.1 C77.1 C78.1 C79.1 C80.1 C81.1 C82.2 C115.1 C116.2 C133.2 C134.2 C135.2 IC5.4(AGND) IC5.12(PGND) IC5.13(PGND) IC5.14(PGND) IC5.15(PGND) IC14.4(AGND) IC14.12(PGND) IC14.13(PGND) IC14.14(PGND) IC14.15(PGND) IC15.2(GND) IC15.4(GND) L23.2 LED1.1(K) LED2.1(K) R67.1 R70.2 R72.1 R74.1 R154.2 R155.1 X20.2
GND_IN: C60.1 D8.2(Anode) D13.A1 D13.A2 L23.1 R139.1 X6.2(PWR_IN) X17.1(GND_IN)
PWR_IN: C60.2 F1.1 X6.1(GND_IN) X17.2(PWR_IN)
V_SUPPLY_FILT: C61.2 C67.2 C68.2 C69.2 C70.2 C78.2 C79.2 C81.2 IC5.7(IN_/_AIN) IC5.8(IN) IC5.9(IN) IC5.22-NC(NC_/_IN) IC14.7(IN_/_AIN) IC14.8(IN) IC14.9(IN) IC14.22-NC(NC_/_IN) IC15.1(Vin) L29.2 R65.1 R68.2 R151.1 R152.2
VSTB: C82.1 IC5.2(EN) IC15.3(Vout) R62.2 R69.1 R71.2 R153.1 R156.2
3.3V_PGOOD: IC5.1(PGOOD) R64.2 R157.2
5V_PGOOD: IC14.1(PGOOD) R150.2
DCDC1_FB1: IC5.5(FB) R66.1 R67.2
DCDC1_LX: C62.1 IC5.10(LX) IC5.11(LX) IC5.16(LX) IC5.17(LX) IC5.18(LX) L8.1
DCDC1_PFM: IC5.3(~{PFM}) R69.2 R70.1
DCDC1_SS: C77.2 IC5.22(SS)
DCDC2_EN: IC14.2(EN) R156.1 R157.1
DCDC2_FB1: IC14.5(FB) R73.1 R74.2
DCDC2_LX: C71.1 IC14.10(LX) IC14.11(LX) IC14.16(LX) IC14.17(LX) IC14.18(LX) L26.1
DCDC2_PFM: IC14.3(~{PFM}) R153.2 R154.1
DCDC2_SS: C76.2 IC14.22(SS)
NetC59_2: C59.2 IC5.21(VCC) R62.1 R64.1 R65.2
NetC62_2: C62.2 IC5.20(BST)
NetC71_2: C71.2 IC14.20(BST)
NetC80_2: C80.2 IC14.21(VCC) R71.1 R150.1 R151.2
NetD8_1: D8.1(Cathode) D13.K F1.2 L29.1
NetIC5_6: IC5.6(TON) R68.1
NetIC5_19: IC5.19(OCS_/_PGND) R72.2
NetIC14_6: IC14.6(TON) R152.1
NetIC14_19: IC14.19(OCS_/_PGND) R155.2
NetLED1_2: LED1.2(A) R81.1
NetLED2_2: LED2.2(A) R82.1

Not connected (* = marked no-connect by the designer): X6 3(PWR_IN)*

### Notes on the sheet
- (near X17) Vin = 6V to 27V (DC)
- (near X17) POWER IN
- Vout = 5V and  3.3V (DC)
- (near X20) 2.54mm Male
- POWER OUT
- Soft Start Time:
- Tss(us) = 330 x Css(nF)
- 3.3V, Iout (max) = 6A
- (near IC5) Refer Note 1
- Note 2:
  - CHASSIS_GND should be connected to GND_IN only at one point, near
  the input power connector.
  - Don't create a closed loop for CHASSIS_GND on the PCB, to avoid any
  loop current.
- (near R68) f(sw) = ~400KHz
- V(FB) = 0.8V
- (near IC5) (DCDC1_EN)
- (near C77) Tss = 3.3mS
- 5.0V, Iout (max) = 6A
- (near R152) f(sw) = ~400KHz
- (near IC14) Refer Note 1
- (near C76) Tss = 3.3mS
- NOTE 1:  Pinout for the AOZ226x for IC5 & IC14 used in this page is a modified pinout, combining multiple devices from  Alpha and Omega family AOZ226x products.
- Alternate parts for L8:
- Please refer device respective device datasheets for details (look for pin 22, 23 details)
- Alternate parts for L26:
- - Inductance (L) = 3.3uH: Abracon, ASPIAIG-F1040-3R3M-T; Pulse, PA4342.332NLT; Bourns, SRP1038A-3R3M; Wurth, 7443330330
- - Inductance (L) = 2.2uH: Abracon, ASPIAIG-F1040-2R2M-T; Pulse, PA4342.222NLT; Bourns, SRP1038A-2R2M; Wurth, 7443330220
- - Inductance (L) = 3.3uH: Abracon, ASPIAIG-F7030-3R3M-T;
- - Inductance (L) = 2.2uH: Abracon, ASPIAIG-F7030-2R2M-T; Pulse, PA5007.222NLT;
- Title
- Size:
- Date:
- A3
- Number:
- Time:
- Revision:
- Sheet
- of
- File:

### Library data of the parts
C59 C80 = C-X5R-4.7uF-10V-10%-0603: as C99 on sheet Colibri; Tolerance: 10%; Type: X5R; Manufacturer Part No.: *; Value: 4.7uF
C60 C62 C71 C81 = C-X7R-100nF-50V-10%-0603: Capacitor Ceramic X7R 100nF 50V 10% 0603; Tolerance: 10%; Type: X7R; Value: 100nF
C61 C67-C70 C78 C79 = C-X5R-10uF-50V-10%-1210: Capacitor Ceramic X5R 10uF 50V 10% 1210; Tolerance: 10%; Type: X5R; Value: 10uF
C63-C66 C72-C75 = C-X5R-47uF-10V-20%-0805: Capacitor Ceramic X5R 47uF 10V 20% 0805; Tolerance: 20%; Type: X5R; Value: 47uF
C76 C77 = C-X7R-10nF-25V-10%-0402: Capacitor Ceramic X7R 10nF 25V 10% 0402; Tolerance: 10%; Type: X7R; Value: 10nF
C82 = C-X5R-22uF-10V-20%-0805: Capacitor Ceramic X5R 22uF 10V 20% 0805; Tolerance: 20%; Type: X5R; Value: 22uF
C115 C116 = C-X7R-100nF-16V-10%-0402: Capacitor Ceramic X7R 100nF 16V 10% 0402; Tolerance: 10%; Type: X7R; Value: 100nF
C133-C135 = C-X7R-1nF-2KV-10%-1206: Capacitor Ceramic X7R 1nF 2KV 10% 1206; Tolerance: 10%; Type: X7R; Value: 1nF
D8 = D-Littelfuse-SMAJ30CA-Schottky: Bidirectional ESD protection; Manufacturer Name: Littelfuse
D13 = D-Vishay-SS8P6C-M3/86A: Diode Schottky, SS8P6C-M3/86A, 60V(Vrrm), 8A(If); Manufacturer: Vishay; Manufacturer Part Number: SS8P6C-M3/86A
F1 = F-Littelfuse-0458008.DR: Fast Fuse, Rated 8A, 63V(DC), 1206 (3216 Metric); Manufacturer Part No.: 0458008.DR; Manufacturer Name: Littelfuse; Value: 8A
IC5 IC14 = IC-A&O-AOZ2260QI-10: 6A (Iout(max)) Synchronous Buck Regulator, QFN-22L (4mmx 4mm), Vin = 6.5V to 28V; Manufacturer Name: Alpha and Omega; Manufacturer Part No.: AOZ2260QI-10
IC15 = IC-ON-NCV4274CST50T3G: LDO regulator, Vout = 5V, Iout(max) = 0.4A, Vin = 5.5V to 40V, SOT-223; Manufacturer Name: ON Semiconductor; Manufacturer Part No.: NCV4274CST50T3G
L8 = L-Pulse-PA5007.332NLT-3.3uH-10A-20%: Inductance 3.3uH, 20%, Irms=10A, Isat=15A, DCR=18 mOhm; Manufacturer Name: Pulse; I (saturation): 15A; Tolerance: 20%; Manufacturer Part No.: PA5007.332NLT; I (RMS): 10A; Value: 3.3uH
L23 L29 = L-Laird-35F0121-0SR-10-10A-25%: Power Supply FB 10A; Tolerance: 25%; Rating: 10A; Value: 36R@100MHz
L26 = L-Laird-MGV10043R3M-10-3.3uH-10A-20%: Inductance 3.3uH, 20%, Irms=10A, Isat=18.6A, DCR=11.8 mOhm; Manufacturer Name: Laird; I (saturation): 18.6; I (RMS): 10; Tolerance: 20%; Manufacturer Part No.: MGV10043R3M-10; Value: 3.3uH
LED1 LED2 = LED-Avago-HSMG-C190: Surface mount LED green 20mA; Manufacturer Name: Avago
MH1-MH4 = MECH-MountingHoles: PCB Mounting Holes, hole diemeter = 3.2mm, pad diameter = 6.2mm
R62 R65 R69-R72 R151 R153-R157 = R-0R-63mW-5%-0603: Resistor 0 ohm 63mW 5% 0603; Rating: 63mW; Tolerance: 5%; Size: 0603 (In); Value: 0R
R64 R150 = R-100KR-63mW-5%-0402: as R100 on sheet Colibri; Rating: 63mW; Tolerance: 5%
R66 R73 = R-47KR-63mW-1%-0402: Resistor 47 Kohm 63mW 1% 0402; Value: 47KR; Rating: 63mW; Tolerance: 1%
R67 = R-15KR-63mW-1%-0402: Resistor 15 Kohm 63mW 1% 0402; Value: 15KR; Rating: 63mW; Tolerance: 1%
R68 = R-330KR-63mW-1%-0402: Resistor 330 Kohm 63mW 1% 0402; Value: 330KR; Rating: 63mW; Tolerance: 1%
R74 = R-8.87KR-63mW-1%-0402: Resistor 8.87 Kohm 63mW 1% 0402; Value: 8.87KR; Rating: 63mW; Tolerance: 1%
R81 = R-560R-63mW-5%-0402: Resistor 560 ohm 63mW 5% 0402; Rating: 63mW; Tolerance: 5%; Value: 560R
R82 = R-1KR-63mW-5%-0402: Resistor 1 Kohm 63mW 5% 0402; Rating: 63mW; Tolerance: 5%; Value: 1K
R139 = R-0R-63mW-1%-1206: Resistor 0 ohm 63mW 1% 1206; Rating: 63mW; Tolerance: 1%; Value: 0R
R152 = R-470KR-63mW-1%-0402: Resistor 470 Kohm 63mW 1% 0402; Value: 470KR; Rating: 63mW; Tolerance: 1%
X6 = CON-SwitchCraft-RAPC722X: Barrel Power Connector; Manufacturer Part No.: RAPC722X; Manufacturer Name: SwitchCraft
X17 = CON-Tyco-284512-2-1x2-3.5mm: Terminal Block Power Connector; Manufacturer Name: Tyco; No. of ways: 1x2; Pitch: 3.5mm; Manufacturer Part No.: 284512-2
X20 = CON-Tyco-826936-3-1X3-2.54mm: Header, 3-Pin; Manufacturer Name: Tyco; No. of ways: 1X3; Pitch: 2.54mm; Manufacturer Part No.: 826936-3

## Sheet DisplayInterface.SchDoc: Iris
size A3; Organization: Toradex AG; Address1: Altsagenstrasse 5; Address2: Horw; Address3: 6048; Address4: Switzerland; DocumentNumber: 9; Revision: V2.0; SheetNumber: 9; SheetTotal: 16
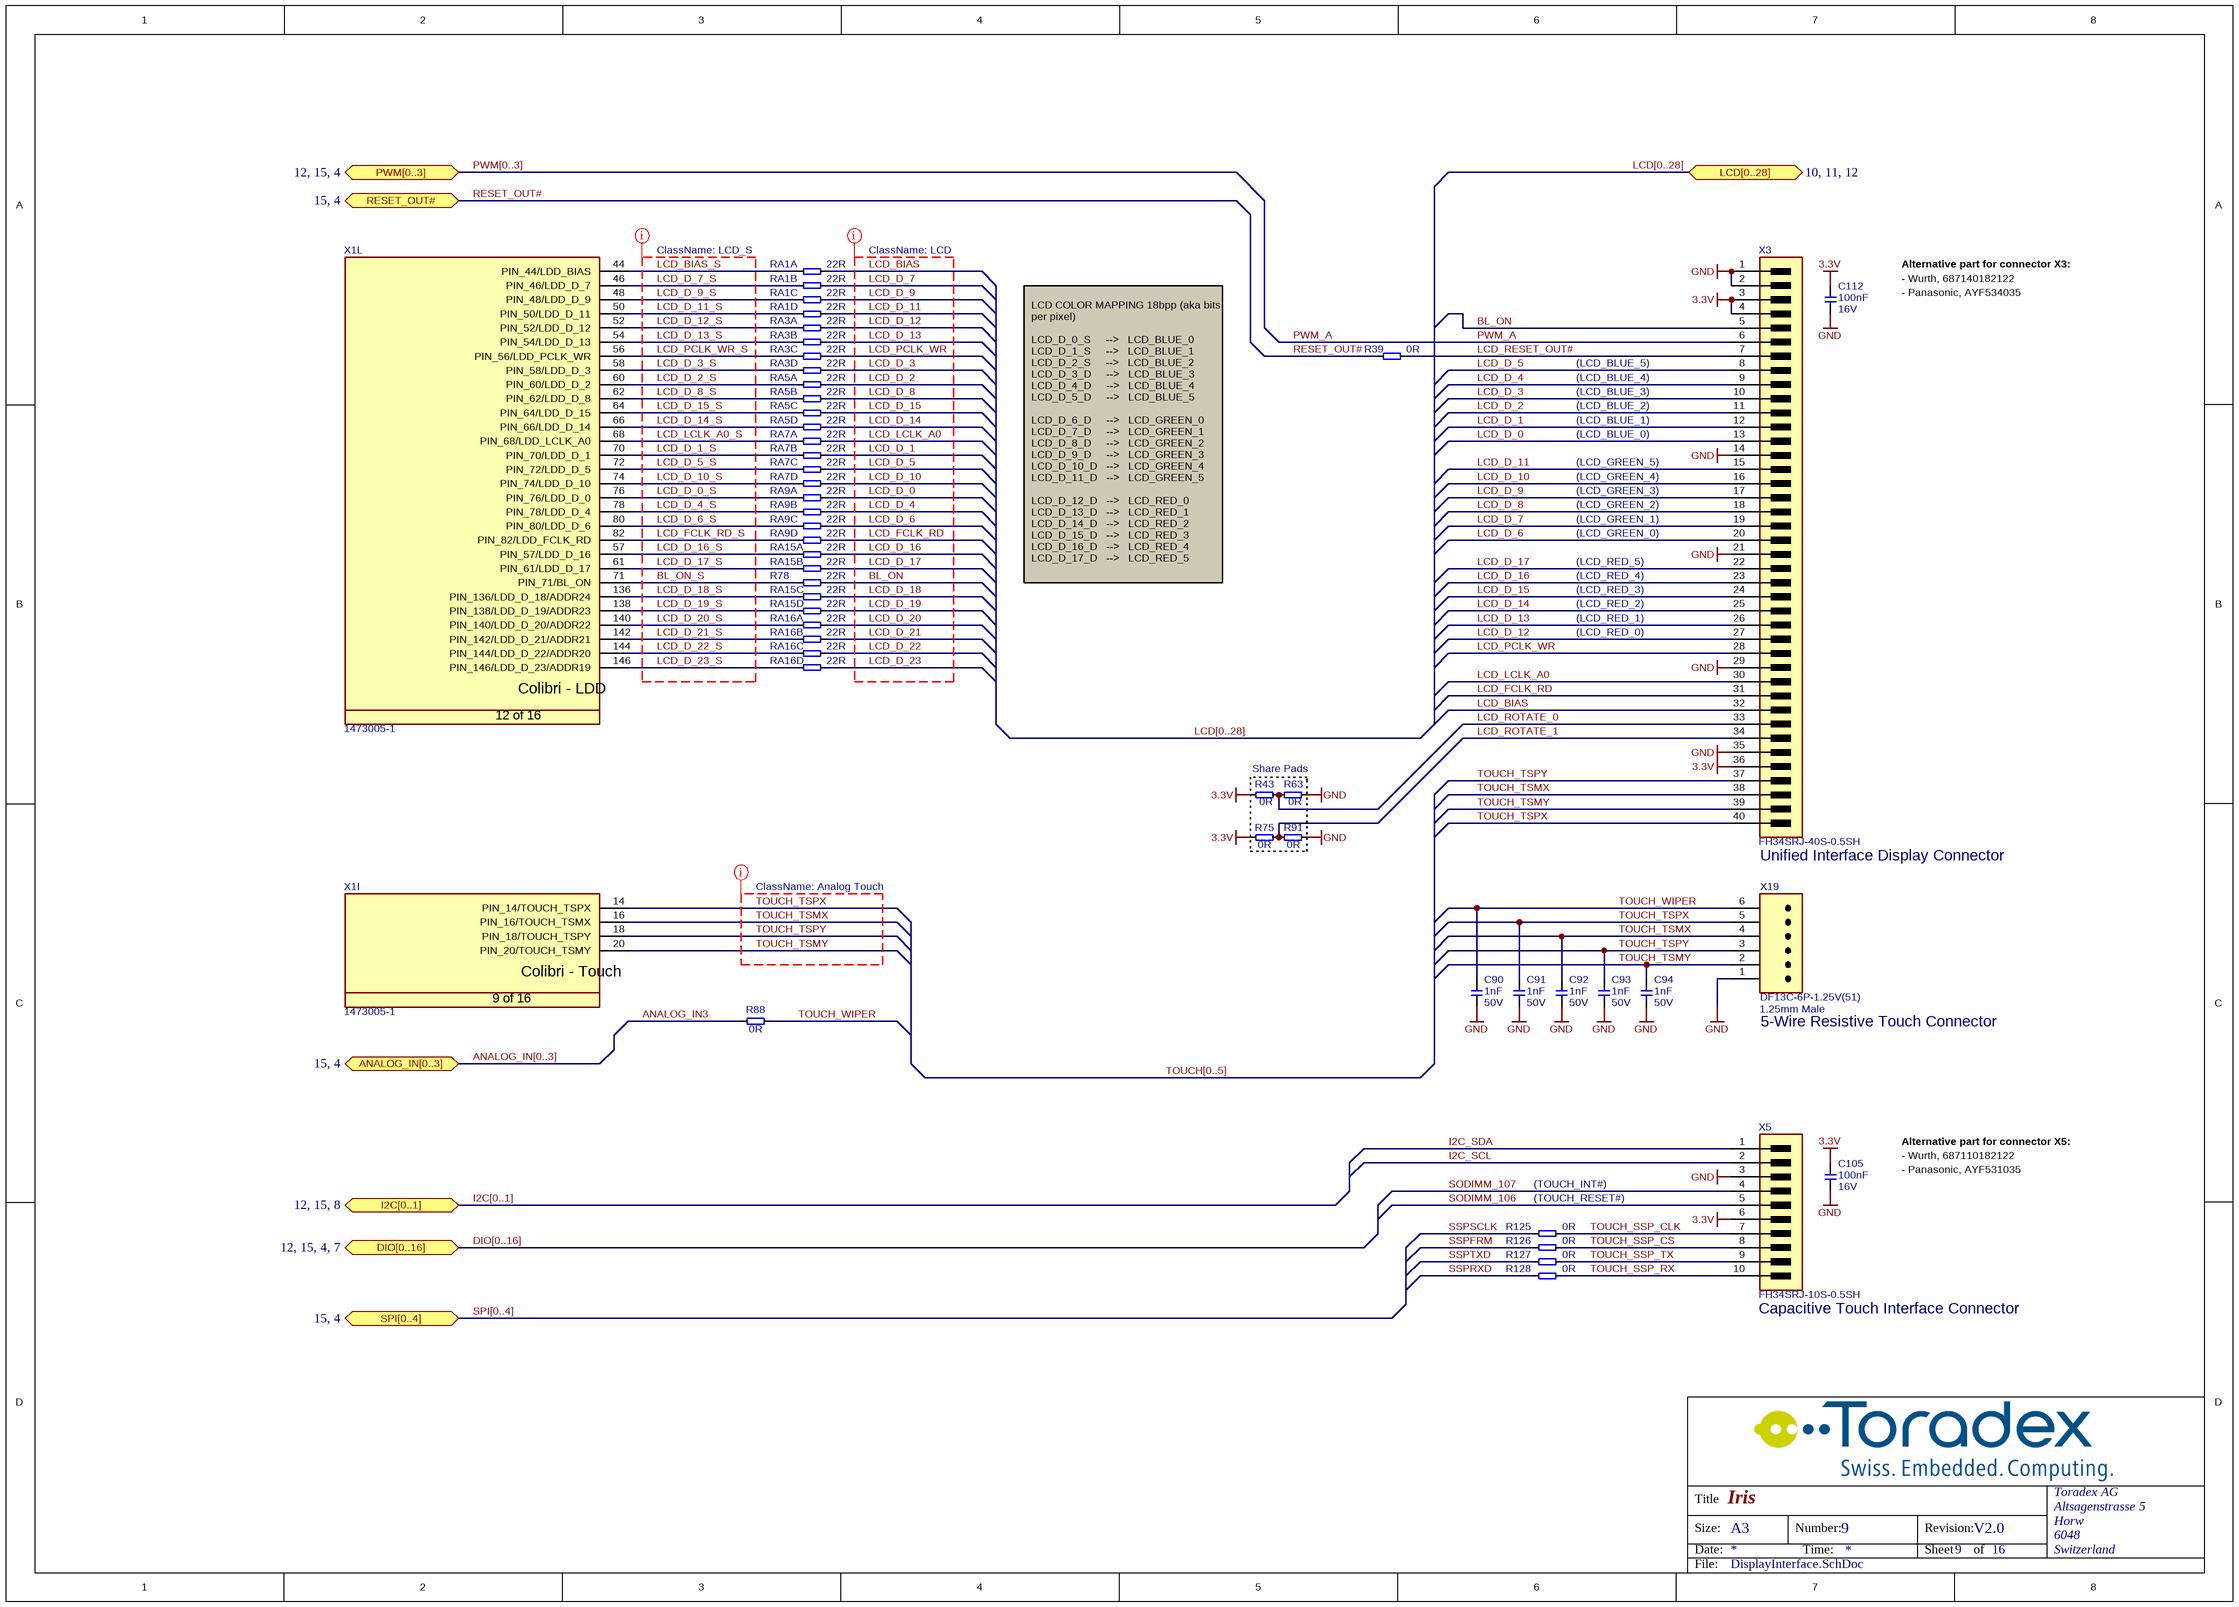
[diagram p5: DisplayInterface.SchDoc]

### Parts
C90  Rating: 50V  [CAPC1005X60N]  (hidden comment: 1nF)
C91  Rating: 50V  [CAPC1005X60N]  (hidden comment: 1nF)
C92  Rating: 50V  [CAPC1005X60N]  (hidden comment: 1nF)
C93  Rating: 50V  [CAPC1005X60N]  (hidden comment: 1nF)
C94  Rating: 50V  [CAPC1005X60N]  (hidden comment: 1nF)
C105  Rating: 16V  [CAPC1005X60N]  (hidden comment: 100nF)
C112  Rating: 16V  [CAPC1005X60N]  (hidden comment: 100nF)
R39  0R  [T_RESC0603X30N]
R43  0R  [T_RESC0603X30N]
R63  0R  [T_RESC0603X30N]
R75  0R  [T_RESC0603X30N]
R78  22R  [RESC1005X40N]
R88  0R  [T_RESC0603X30N]
R91  0R  [T_RESC0603X30N]
R125  0R  [T_RESC0603X30N]
R126  0R  [T_RESC0603X30N]
R127  0R  [T_RESC0603X30N]
R128  0R  [T_RESC0603X30N]
RA1  22R  [T_Resistor_Array_X4]  (parts A,B,C,D of 4)
RA3  22R  [T_Resistor_Array_X4]  (parts A,B,C,D of 4)
RA5  22R  [T_Resistor_Array_X4]  (parts A,B,C,D of 4)
RA7  22R  [T_Resistor_Array_X4]  (parts A,B,C,D of 4)
RA9  22R  [T_Resistor_Array_X4]  (parts A,B,C,D of 4)
RA15  22R  [T_Resistor_Array_X4]  (parts A,B,C,D of 4)
RA16  22R  [T_Resistor_Array_X4]  (parts A,B,C,D of 4)
X1  1473005-1  [T_Tyco_1473005-1]  (parts I,L of 16)
X3  FH34SRJ-40S-0.5SH  [T_Hirose_FH34SRJ-40S-0.5SH]
X5  FH34SRJ-10S-0.5SH  [T_Hirose_FH34SRJ-10S-0.5SH]
X19  DF13C-6P-1.25V(51)  [T_HIROSE_DF13C-6P-1.25V(51)]

### Blocks framed on the sheet
Share Pads: R43 R63 R75 R91

### Ports
ANALOG_IN[0..3] (bidir, see 15, 4), DIO[0..16] (bidir, see 12, 15, 4, 7), I2C[0..1] (bidir, see 12, 15, 8), LCD[0..28] (bidir, see 10, 11, 12), PWM[0..3] (bidir, see 12, 15, 4), RESET_OUT# (bidir, see 15, 4), SPI[0..4] (bidir, see 15, 4)

### Nets
3.3V: C105.2 C112.2 R43.1 R75.1 X3.3 X3.4 X3.36 X5.6
GND: C90.1 C91.1 C92.1 C93.1 C94.1 C105.1 C112.1 R63.2 R91.1 X3.1 X3.2 X3.14 X3.21 X3.29 X3.35 X5.3 X19.1(GND)
ANALOG_IN3: R88.2
BL_ON: R78.2 X3.5
BL_ON_S: R78.1 X1.71(PIN_71/BL_ON)
I2C_SCL: X5.2
I2C_SDA: X5.1
LCD_BIAS: RA1.5 X3.32
LCD_BIAS_S: RA1.1 X1.44(PIN_44/LDD_BIAS)
LCD_D_0: RA9.5 X3.13
LCD_D_0_S: RA9.1 X1.76(PIN_76/LDD_D_0)
LCD_D_1: RA7.6 X3.12
LCD_D_1_S: RA7.2 X1.70(PIN_70/LDD_D_1)
LCD_D_2: RA5.5 X3.11
LCD_D_2_S: RA5.1 X1.60(PIN_60/LDD_D_2)
LCD_D_3: RA3.8 X3.10
LCD_D_3_S: RA3.4 X1.58(PIN_58/LDD_D_3)
LCD_D_4: RA9.6 X3.9
LCD_D_4_S: RA9.2 X1.78(PIN_78/LDD_D_4)
LCD_D_5: RA7.7 X3.8
LCD_D_5_S: RA7.3 X1.72(PIN_72/LDD_D_5)
LCD_D_6: RA9.7 X3.20
LCD_D_6_S: RA9.3 X1.80(PIN_80/LDD_D_6)
LCD_D_7: RA1.6 X3.19
LCD_D_7_S: RA1.2 X1.46(PIN_46/LDD_D_7)
LCD_D_8: RA5.6 X3.18
LCD_D_8_S: RA5.2 X1.62(PIN_62/LDD_D_8)
LCD_D_9: RA1.7 X3.17
LCD_D_9_S: RA1.3 X1.48(PIN_48/LDD_D_9)
LCD_D_10: RA7.8 X3.16
LCD_D_10_S: RA7.4 X1.74(PIN_74/LDD_D_10)
LCD_D_11: RA1.8 X3.15
LCD_D_11_S: RA1.4 X1.50(PIN_50/LDD_D_11)
LCD_D_12: RA3.5 X3.27
LCD_D_12_S: RA3.1 X1.52(PIN_52/LDD_D_12)
LCD_D_13: RA3.6 X3.26
LCD_D_13_S: RA3.2 X1.54(PIN_54/LDD_D_13)
LCD_D_14: RA5.8 X3.25
LCD_D_14_S: RA5.4 X1.66(PIN_66/LDD_D_14)
LCD_D_15: RA5.7 X3.24
LCD_D_15_S: RA5.3 X1.64(PIN_64/LDD_D_15)
LCD_D_16: RA15.5 X3.23
LCD_D_16_S: RA15.1 X1.57(PIN_57/LDD_D_16)
LCD_D_17: RA15.6 X3.22
LCD_D_17_S: RA15.2 X1.61(PIN_61/LDD_D_17)
LCD_D_18: RA15.7
LCD_D_18_S: RA15.3 X1.136(PIN_136/LDD_D_18/ADDR24)
LCD_D_19: RA15.8
LCD_D_19_S: RA15.4 X1.138(PIN_138/LDD_D_19/ADDR23)
LCD_D_20: RA16.5
LCD_D_20_S: RA16.1 X1.140(PIN_140/LDD_D_20/ADDR22)
LCD_D_21: RA16.6
LCD_D_21_S: RA16.2 X1.142(PIN_142/LDD_D_21/ADDR21)
LCD_D_22: RA16.7
LCD_D_22_S: RA16.3 X1.144(PIN_144/LDD_D_22/ADDR20)
LCD_D_23: RA16.8
LCD_D_23_S: RA16.4 X1.146(PIN_146/LDD_D_23/ADDR19)
LCD_FCLK_RD: RA9.8 X3.31
LCD_FCLK_RD_S: RA9.4 X1.82(PIN_82/LDD_FCLK_RD)
LCD_LCLK_A0: RA7.5 X3.30
LCD_LCLK_A0_S: RA7.1 X1.68(PIN_68/LDD_LCLK_A0)
LCD_PCLK_WR: RA3.7 X3.28
LCD_PCLK_WR_S: RA3.3 X1.56(PIN_56/LDD_PCLK_WR)
LCD_RESET_OUT#: R39.2 X3.7
LCD_ROTATE_0: R43.2 R63.1 X3.33
LCD_ROTATE_1: R75.2 R91.2 X3.34
PWM_A: X3.6
RESET_OUT#: R39.1 ; port RESET_OUT#
SODIMM_106: X5.5
SODIMM_107: X5.4
SSPFRM: R126.1
SSPRXD: R128.1
SSPSCLK: R125.1
SSPTXD: R127.1
TOUCH_SSP_CLK: R125.2 X5.7
TOUCH_SSP_CS: R126.2 X5.8
TOUCH_SSP_RX: R128.2 X5.10
TOUCH_SSP_TX: R127.2 X5.9
TOUCH_TSMX: C92.2 X1.16(PIN_16/TOUCH_TSMX) X3.38 X19.4(TSMX)
TOUCH_TSMY: C94.2 X1.20(PIN_20/TOUCH_TSMY) X3.39 X19.2(TSMY)
TOUCH_TSPX: C91.2 X1.14(PIN_14/TOUCH_TSPX) X3.40 X19.5(TSPX)
TOUCH_TSPY: C93.2 X1.18(PIN_18/TOUCH_TSPY) X3.37 X19.3(TSPY)
TOUCH_WIPER: C90.2 R88.1 X19.6(WIPER)

### Buses and harness runs
bus ANALOG_IN[0..3] = port ANALOG_IN[0..3]
bus DIO[0..16] = port DIO[0..16]
bus I2C[0..1] = port I2C[0..1]
bus LCD[0..28] = port LCD[0..28]
bus PWM[0..3] = port PWM[0..3]
bus SPI[0..4] = port SPI[0..4]
bus TOUCH[0..5]

### Layout directives
net class Analog Touch: TOUCH_TSMX, TOUCH_TSMY, TOUCH_TSPX, TOUCH_TSPY
net class LCD: BL_ON, LCD_BIAS, LCD_D_0, LCD_D_1, LCD_D_2, LCD_D_3, LCD_D_4, LCD_D_5, LCD_D_6, LCD_D_7, LCD_D_8, LCD_D_9, LCD_D_10, LCD_D_11, LCD_D_12, LCD_D_13, LCD_D_14, LCD_D_15, LCD_D_16, LCD_D_17, LCD_D_18, LCD_D_19, LCD_D_20, LCD_D_21, LCD_D_22, LCD_D_23, LCD_FCLK_RD, LCD_LCLK_A0, LCD_PCLK_WR
net class LCD_S: BL_ON_S, LCD_BIAS_S, LCD_D_0_S, LCD_D_1_S, LCD_D_2_S, LCD_D_3_S, LCD_D_4_S, LCD_D_5_S, LCD_D_6_S, LCD_D_7_S, LCD_D_8_S, LCD_D_9_S, LCD_D_10_S, LCD_D_11_S, LCD_D_12_S, LCD_D_13_S, LCD_D_14_S, LCD_D_15_S, LCD_D_16_S, LCD_D_17_S, LCD_D_18_S, LCD_D_19_S, LCD_D_20_S, LCD_D_21_S, LCD_D_22_S, LCD_D_23_S, LCD_FCLK_RD_S, LCD_LCLK_A0_S, LCD_PCLK_WR_S

### Notes on the sheet
- Alternative part for connector X3:
- - Wurth, 687140182122
- - Panasonic, AYF534035
- (LCD_BLUE_2)
- (LCD_BLUE_3)
- (LCD_BLUE_4)
- (LCD_BLUE_5)
- (LCD_BLUE_0)
- (LCD_BLUE_1)
- (LCD_GREEN_4)
- (LCD_GREEN_5)
- (LCD_GREEN_0)
- (LCD_GREEN_1)
- (LCD_GREEN_2)
- (LCD_GREEN_3)
- LCD COLOR MAPPING 18bpp (aka bits
  per pixel)
  LCD_D_0_S     -->   LCD_BLUE_0
  LCD_D_1_S     -->   LCD_BLUE_1
  LCD_D_2_S     -->   LCD_BLUE_2
  LCD_D_3_D     -->   LCD_BLUE_3
  LCD_D_4_D     -->   LCD_BLUE_4
  LCD_D_5_D     -->   LCD_BLUE_5
  LCD_D_6_D     -->   LCD_GREEN_0
  LCD_D_7_D     -->   LCD_GREEN_1
  LCD_D_8_D     -->   LCD_GREEN_2
  LCD_D_9_D     -->   LCD_GREEN_3
  LCD_D_10_D   -->   LCD_GREEN_4
  LCD_D_11_D   -->   LCD_GREEN_5
  LCD_D_12_D   -->   LCD_RED_0
  LCD_D_13_D   -->   LCD_RED_1
  LCD_D_14_D   -->   LCD_RED_2
  LCD_D_15_D   -->   LCD_RED_3
  LCD_D_16_D   -->   LCD_RED_4
  LCD_D_17_D   -->   LCD_RED_5
- (LCD_RED_1)
- (LCD_RED_2)
- (LCD_RED_3)
- (LCD_RED_4)
- (LCD_RED_5)
- (LCD_RED_0)
- (near X3) Unified Interface Display Connector
- (near X19) 1.25mm Male
- (near X19) 5-Wire Resistive Touch Connector
- (TOUCH_INT#)
- (TOUCH_RESET#)
- Alternative part for connector X5:
- - Wurth, 687110182122
- - Panasonic, AYF531035
- (near X5) Capacitive Touch Interface Connector
- Title
- Size:
- Date:
- A3
- Number:
- Time:
- Revision:
- Sheet
- of
- File:
- (in symbol CON-Tyco-1473005-1-200-0.6mm, part I) Colibri - Touch; 9 of 16
- (in symbol CON-Tyco-1473005-1-200-0.6mm, part L) Colibri - LDD; 12 of 16

### Library data of the parts
C90-C94 = C-X7R-1nF-50V-10%-0402: Capacitor Ceramic X7R 1nF 50V 10% 0402; Tolerance: 10%; Type: X7R; Value: 1nF
C105 C112 = C-X7R-100nF-16V-10%-0402: Capacitor Ceramic X7R 100nF 16V 10% 0402; Tolerance: 10%; Type: X7R; Value: 100nF
R39 R43 R63 R75 R88 R91 R125-R128 = R-0R-63mW-5%-0603: Resistor 0 ohm 63mW 5% 0603; Rating: 63mW; Tolerance: 5%; Value: 0R; Size: 0603 (In)
R78 = R-22R-63mW-5%-0402: Resistor 22 ohm 63mW 5% 0402; Rating: 63mW; Tolerance: 5%; Value: 22R
RA1 RA3 RA5 RA7 RA9 RA15 RA16 = RA-22R-63mW-5%-1206-div: as RA2 on sheet Colibri; Tolerance: 5%; Power Dissipation: 63mW; Manufacturer Part Number: *; Value: 22R
X1 = CON-Tyco-1473005-1-200-0.6mm: as X1 on sheet Colibri; Manufacturer Part No.: 1473005-1
X3 = CON-Hirose-FH34SRJ-40S-0.5SH: FFC Connector, 40 pin, 0.5mm pitch, dual side contact; Manufacturer Name: Hirose; No. of ways: 40; Pitch: 0.5mm; Manufacturer Part No.: FH34SRJ-40S-0.5SH
X5 = CON-Hirose-FH34SRJ-10S-0.5SH: FFC Connector, 10 pin, 0.5mm pitch, dual side contact; Manufacturer Name: Hirose; No. of ways: 10; Pitch: 0.5mm; Manufacturer Part No.: FH34SRJ-10S-0.5SH
X19 = CON-Hirose-DF13C-6P-1.25V(51)-1x6-1.25mm: Touch Connector; Manufacturer Name: Hirose; No. of ways: 1X6; Pitch: 1.25mm; Manufacturer Part No.: DF13C-6P-1.25V(51)

## Sheet SDCard.SchDoc: Iris
size A3; Organization: Toradex AG; Address1: Altsagenstrasse 5; Address2: Horw; Address3: 6048; Address4: Switzerland; DocumentNumber: 7; Revision: V2.0; SheetNumber: 7; SheetTotal: 16
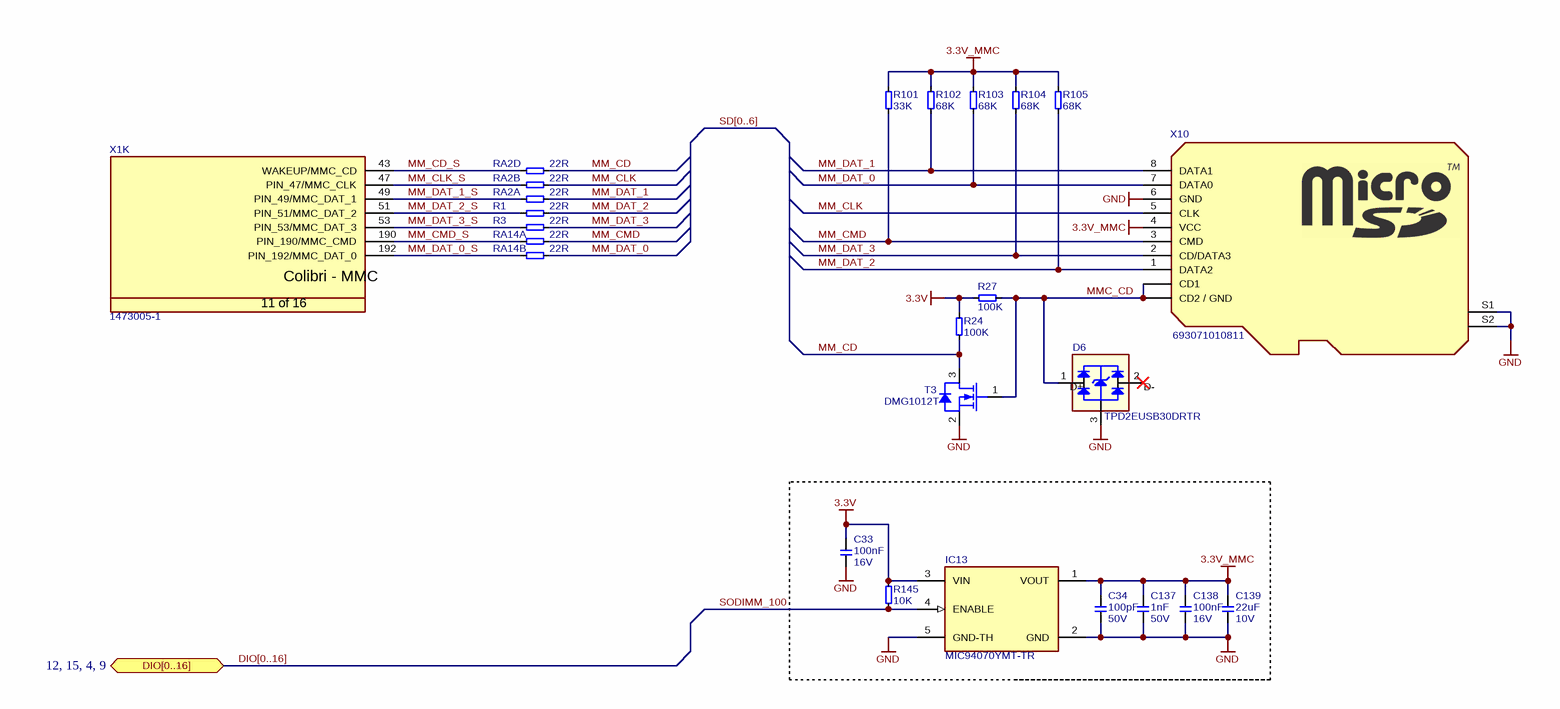
[diagram p6: SDCard.SchDoc]

### Parts
C33  Rating: 16V  [CAPC1005X60N]  (hidden comment: 100nF)
C34  Rating: 50V  [CAPC1005X60N]  (hidden comment: 100pF)
C137  Rating: 50V  [CAPC1005X60N]  (hidden comment: 1nF)
C138  Rating: 16V  [CAPC1005X60N]  (hidden comment: 100nF)
C139  Rating: 10V  [T_CAPC0805X125N]  (hidden comment: 22uF)
D6  TPD2EUSB30DRTR  [T_TI_TPD2EUSB30DRTR]
IC13  MIC94070YMT-TR  [T_TDFN0P120X160X60-4N]
R1  22R  [RESC1005X40N]
R3  22R  [RESC1005X40N]
R24  100K  [T_RESC0603X30N]
R27  100K  [T_RESC0603X30N]
R101  33K  [RESC1005X40N]
R102  68K  [RESC1005X40N]
R103  68K  [RESC1005X40N]
R104  68K  [RESC1005X40N]
R105  68K  [RESC1005X40N]
R145  10K  [T_RESC0603X30N]
RA2  22R  [T_Resistor_Array_X4]  (parts A,B,D of 4)
RA14  22R  [T_Resistor_Array_X4]  (parts A,B of 4)
T3  Manufacturer Part No.: DMG1012T  [T_SOT50P160X80-3N]  (hidden comment: T-DiodeInc-DMG1012T)
X1  1473005-1  [T_Tyco_1473005-1]  (part K of 16)
X10  Manufacturer Part No.: 693071010811  [T_Wurth_693071010811]  (hidden comment: MicroSD Holder)

### Ports
DIO[0..16] (bidir, see 12, 15, 4, 9)

### Nets
3.3V: C33.2 IC13.3(VIN) R24.2 R27.2 R145.2
3.3V_MMC: C34.2 C137.2 C138.2 C139.2 IC13.1(VOUT) R101.2 R102.2 R103.2 R104.2 R105.2 X10.4(VCC)
GND: C33.1 C34.1 C137.1 C138.1 C139.1 D6.3 IC13.2(GND) IC13.5(GND-TH) T3.2(S) X10.6(GND) X10.S1(S) X10.S2(S)
MM_CD: R24.1 RA2.8 T3.3(D)
MM_CD_S: RA2.4 X1.43(WAKEUP/MMC_CD)
MM_CLK: RA2.6 X10.5(CLK)
MM_CLK_S: RA2.2 X1.47(PIN_47/MMC_CLK)
MM_CMD: R101.1 RA14.5 X10.3(CMD)
MM_CMD_S: RA14.1 X1.190(PIN_190/MMC_CMD)
MM_DAT_0: R103.1 RA14.6 X10.7(DATA0)
MM_DAT_0_S: RA14.2 X1.192(PIN_192/MMC_DAT_0)
MM_DAT_1: R102.1 RA2.5 X10.8(DATA1)
MM_DAT_1_S: RA2.1 X1.49(PIN_49/MMC_DAT_1)
MM_DAT_2: R1.2 R105.1 X10.1(DATA2)
MM_DAT_2_S: R1.1 X1.51(PIN_51/MMC_DAT_2)
MM_DAT_3: R3.2 R104.1 X10.2(CD/DATA3)
MM_DAT_3_S: R3.1 X1.53(PIN_53/MMC_DAT_3)
MMC_CD: D6.1(D+) R27.1 T3.1(G) X10.CD1 X10.CD2(CD2_/_GND)
SODIMM_100: IC13.4(ENABLE) R145.1

Not connected (* = marked no-connect by the designer): D6 2(D-)*

### Buses and harness runs
bus DIO[0..16] = port DIO[0..16]
bus SD[0..6]

### Notes on the sheet
- Title
- Size:
- Date:
- A3
- Number:
- Time:
- Revision:
- Sheet
- of
- File:
- (in symbol CON-Tyco-1473005-1-200-0.6mm, part K) Colibri - MMC; 11 of 16

### Library data of the parts
C33 C138 = C-X7R-100nF-16V-10%-0402: Capacitor Ceramic X7R 100nF 16V 10% 0402; Tolerance: 10%; Type: X7R; Value: 100nF
C34 = C-X7R-100pF-50V-10%-0402: Capacitor Ceramic X7R 100pF 50V 10% 0402; Tolerance: 10%; Type: X7R; Value: 100pF
C137 = C-X7R-1nF-50V-10%-0402: Capacitor Ceramic X7R 1nF 50V 10% 0402; Tolerance: 10%; Type: X7R; Value: 1nF
C139 = C-X5R-22uF-10V-20%-0805: Capacitor Ceramic X5R 22uF 10V 20% 0805; Tolerance: 20%; Type: X5R; Value: 22uF
D6 = D-TI-TPD2EUSB30DRTR: 2 Channel Protection for Super Speed USB3.0; Manufacturer Name: TI; Manufacturer Part No.: TPD2EUSB30DRTR
IC13 = IC-Microchip-MIC94070YMT-TR: High Side Load Switch, TDFN4 1.2 x 1.6; Manufacturer Name: Microchip; Package: TDFN-4; Manufacturer Part No.: MIC94070YMT-TR
R1 R3 = R-22R-63mW-5%-0402: Resistor 22 ohm 63mW 5% 0402; Rating: 63mW; Tolerance: 5%; Value: 22R
R24 R27 = R-100KR-63mW-5%-0603: Resistor 100 Kohm 63mW 5% 0603; Value: 100KR; Rating: 63mW; Tolerance: 5%
R101 = R-33KR-63mW-5%-0402: Resistor 33 Kohm 63mW 5% 0402; Value: 33KR; Rating: 63mW; Tolerance: 5%
R102-R105 = R-68KR-63mW-5%-0402: Resistor 68 Kohm 63mW 5% 0402; Value: 68KR; Rating: 63mW; Tolerance: 5%
R145 = R-10KR-63mW-5%-0603: Resistor 10 Kohm 63mW 5% 0603; Value: 10KR; Rating: 63mW; Tolerance: 5%
RA2 RA14 = RA-22R-63mW-5%-1206-div: as RA2 on sheet Colibri; Tolerance: 5%; Power Dissipation: 63mW; Manufacturer Part Number: *; Value: 22R
T3 = T-DiodeInc-DMG1012T: N-Channel 20V (D-S)  MOSFET; Manufacturer Name: Diode Inc
X1 = CON-Tyco-1473005-1-200-0.6mm: as X1 on sheet Colibri; Manufacturer Part No.: 1473005-1
X10 = CON-Wurth-693071010811: Micro SD Holder Push Push CD; Manufacturer Name: Wurth; No. of ways: 9

## Sheet Extension.SCHDOC: Iris
size A3; Organization: Toradex AG; Address1: Altsagenstrasse 5; Address2: Horw; Address3: 6048; Address4: Switzerland; DocumentNumber: 15; Revision: V2.0; SheetNumber: 15; SheetTotal: 16
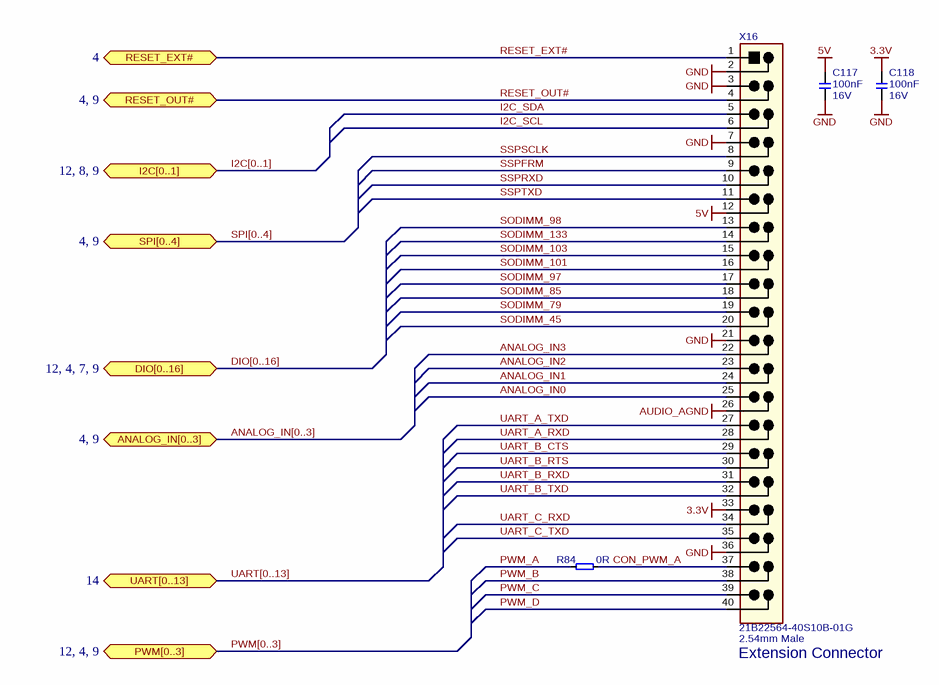
[diagram p7: Extension.SCHDOC]

### Parts
C117  Rating: 16V  [CAPC1005X60N]  (hidden comment: 100nF)
C118  Rating: 16V  [CAPC1005X60N]  (hidden comment: 100nF)
R84  0R  [T_RESC0603X30N]
X16  21B22564-40S10B-01G  [T_JVE_21B22564-40S10B-01G]

### Ports
ANALOG_IN[0..3] (bidir, see 4, 9), DIO[0..16] (bidir, see 12, 4, 7, 9), I2C[0..1] (bidir, see 12, 8, 9), PWM[0..3] (bidir, see 12, 4, 9), RESET_EXT# (bidir, see 4), RESET_OUT# (bidir, see 4, 9), SPI[0..4] (bidir, see 4, 9), UART[0..13] (bidir, see 14)

### Nets
3.3V: C118.2 X16.33
5V: C117.2 X16.12
AUDIO_AGND: X16.26
GND: C117.1 C118.1 X16.2 X16.3 X16.7 X16.21 X16.36
ANALOG_IN0: X16.25
ANALOG_IN1: X16.24
ANALOG_IN2: X16.23
ANALOG_IN3: X16.22
CON_PWM_A: R84.2 X16.37
I2C_SCL: X16.6
I2C_SDA: X16.5
PWM_A: R84.1
PWM_B: X16.38
PWM_C: X16.39
PWM_D: X16.40
RESET_EXT#: X16.1 ; port RESET_EXT#
RESET_OUT#: X16.4 ; port RESET_OUT#
SODIMM_45: X16.20
SODIMM_79: X16.19
SODIMM_85: X16.18
SODIMM_97: X16.17
SODIMM_98: X16.13
SODIMM_101: X16.16
SODIMM_103: X16.15
SODIMM_133: X16.14
SSPFRM: X16.9
SSPRXD: X16.10
SSPSCLK: X16.8
SSPTXD: X16.11
UART_A_RXD: X16.28
UART_A_TXD: X16.27
UART_B_CTS: X16.29
UART_B_RTS: X16.30
UART_B_RXD: X16.31
UART_B_TXD: X16.32
UART_C_RXD: X16.34
UART_C_TXD: X16.35

### Buses and harness runs
bus ANALOG_IN[0..3] = port ANALOG_IN[0..3]
bus DIO[0..16] = port DIO[0..16]
bus I2C[0..1] = port I2C[0..1]
bus PWM[0..3] = port PWM[0..3]
bus SPI[0..4] = port SPI[0..4]
bus UART[0..13] = port UART[0..13]

### Notes on the sheet
- (near X16) Extension Connector
- (near X16) 2.54mm Male
- Title
- Size:
- Date:
- A3
- Number:
- Time:
- Revision:
- Sheet
- of
- File:

### Library data of the parts
C117 C118 = C-X7R-100nF-16V-10%-0402: Capacitor Ceramic X7R 100nF 16V 10% 0402; Tolerance: 10%; Type: X7R; Value: 100nF
R84 = R-0R-63mW-5%-0603: Resistor 0 ohm 63mW 5% 0603; Rating: 63mW; Tolerance: 5%; Value: 0R; Size: 0603 (In)
X16 = CON-JVE-21B22564-40S10B-01G-2X20-2.54mm: 2X20 PIN Header 2.54mm; Manufacturer Name: JVE; No. of ways: 2X20; Manufacturer Part No.: 21B22564-40S10B-01G

## Sheet Ethernet.SchDoc: Iris
size A3; Organization: Toradex AG; Address1: Altsagenstrasse 5; Address2: Horw; Address3: 6048; Address4: Switzerland; DocumentNumber: 5; Revision: V2.0; SheetNumber: 5; SheetTotal: 16
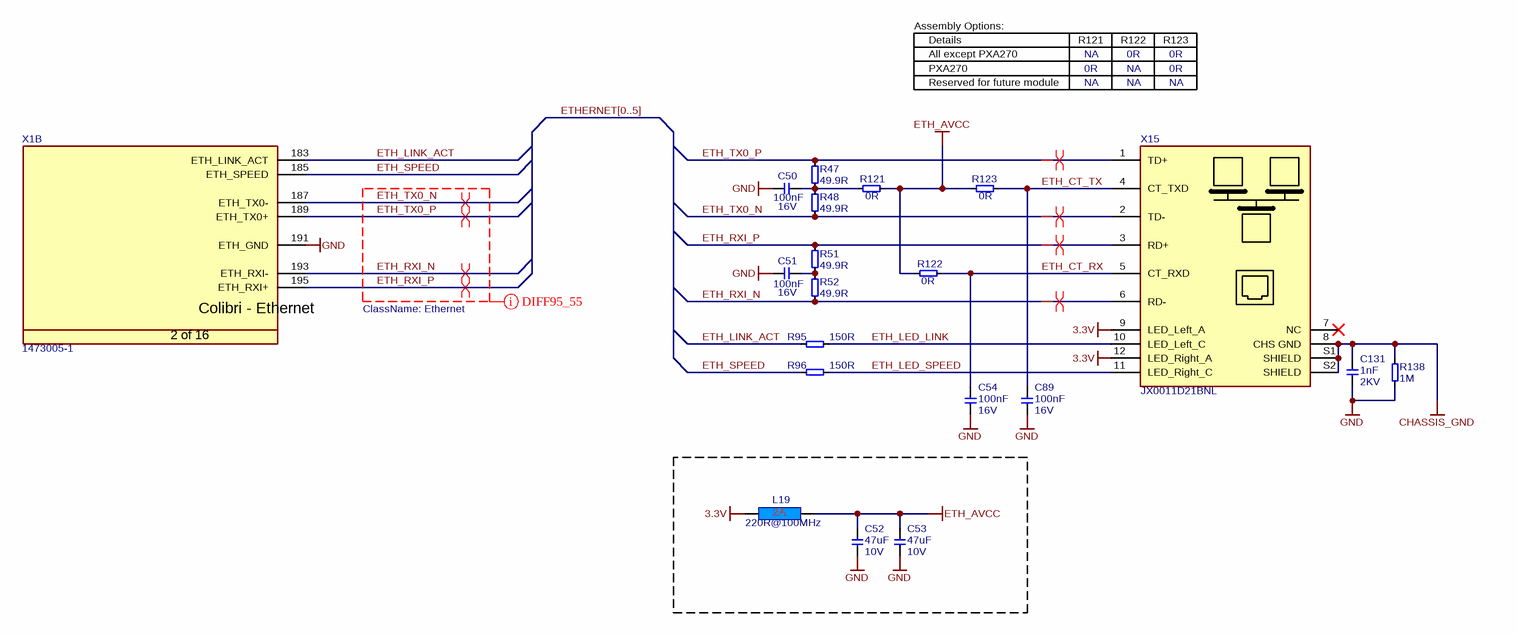
[diagram p8: Ethernet.SchDoc]

### Parts
C50  Rating: 16V  [CAPC1005X60N]  (hidden comment: 100nF)
C51  Rating: 16V  [CAPC1005X60N]  (hidden comment: 100nF)
C52  Rating: 10V  [T_CAPC0805X125N]  (hidden comment: 47uF)
C53  Rating: 10V  [T_CAPC0805X125N]  (hidden comment: 47uF)
C54  Rating: 16V  [CAPC1005X60N]  (hidden comment: 100nF)
C89  Rating: 16V  [CAPC1005X60N]  (hidden comment: 100nF)
C131  Rating: 2KV  [T_CAPC1206X180N]  (hidden comment: 1nF)
L19  220R@100MHz  [INDC1608X95N]
R47  49.9R  [RESC1005X40N]
R48  49.9R  [RESC1005X40N]
R51  49.9R  [RESC1005X40N]
R52  49.9R  [RESC1005X40N]
R95  150R  [RESC1005X40N]
R96  150R  [RESC1005X40N]
R121  0R  [T_RESC0603X30N]
R122  0R  [T_RESC0603X30N]
R123  0R  [T_RESC0603X30N]
R138  1M  [T_RESC0603X30N]
X1  1473005-1  [T_Tyco_1473005-1]  (part B of 16)
X15  JX0011D21BNL  [T_Pulse_J00-0065NL]

### Nets
3.3V: L19.1 X15.9(LED_Left_A) X15.12(LED_Right_A)
CHASSIS_GND: C131.2 R138.2 X15.8(CHS_GND) X15.S1(SHIELD) X15.S2(SHIELD)
ETH_AVCC: C52.1 C53.1 L19.2 R121.2 R122.1 R123.1
GND: C50.1 C51.1 C52.2 C53.2 C54.1 C89.1 C131.1 R138.1 X1.191(ETH_GND)
ETH_CT_RX: C54.2 R122.2 X15.5(CT_RXD)
ETH_CT_TX: C89.2 R123.2 X15.4(CT_TXD)
ETH_LED_LINK: R95.2 X15.10(LED_Left_C)
ETH_LED_SPEED: R96.2 X15.11(LED_Right_C)
ETH_LINK_ACT: R95.1 X1.183(ETH_LINK_ACT)
ETH_RXI_N: R52.1 X1.193(ETH_RXI-) X15.6(RD-)
ETH_RXI_P: R51.2 X1.195(ETH_RXI+) X15.3(RD+)
ETH_SPEED: R96.1 X1.185(ETH_SPEED)
ETH_TX0_N: R48.1 X1.187(ETH_TX0-) X15.2(TD-)
ETH_TX0_P: R47.2 X1.189(ETH_TX0+) X15.1(TD+)
NetC50_2: C50.2 R47.1 R48.2 R121.1
NetC51_2: C51.2 R51.1 R52.2

Not connected (* = marked no-connect by the designer): X15 7(NC)*

### Buses and harness runs
bus ETHERNET[0..5]

### Layout directives
differential pair: ETH_RXI_N, ETH_RXI_P, ETH_TX0_N, ETH_TX0_P
net class Ethernet: ETH_RXI_N, ETH_RXI_P, ETH_TX0_N, ETH_TX0_P

### Notes on the sheet
- Assembly Options:
- All except PXA270
- PXA270
- Reserved for future module
- Details
- R121
- NA
- 0R
- R122
- R123
- Title
- Size:
- Date:
- A3
- Number:
- Time:
- Revision:
- Sheet
- of
- File:
- (in symbol CON-Tyco-1473005-1-200-0.6mm, part B) Colibri - Ethernet; 2 of 16

### Library data of the parts
C50 C51 C54 C89 = C-X7R-100nF-16V-10%-0402: Capacitor Ceramic X7R 100nF 16V 10% 0402; Tolerance: 10%; Type: X7R; Value: 100nF
C52 C53 = C-X5R-47uF-10V-20%-0805: Capacitor Ceramic X5R 47uF 10V 20% 0805; Tolerance: 20%; Type: X5R; Value: 47uF
C131 = C-X7R-1nF-2KV-10%-1206: Capacitor Ceramic X7R 1nF 2KV 10% 1206; Tolerance: 10%; Type: X7R; Value: 1nF
L19 = L-220R@100MHz-2A-25%-0603: 220R@100MHz 2A EMI FILTER; Tolerance: 25%; Rating: 2A; Value: 220R@100MHz
R47 R48 R51 R52 = R-49.9R-100mW-1%-0402: Resistor 49.9 ohm 100mW 1% 0402; Rating: 100mW; Tolerance: 1%; Value: 49.9R; Size: 0402
R95 R96 = R-150R-63mW-5%-0402: Resistor 150 ohm 63mW 5% 0402; Tolerance: 5%; Value: 150R; Rating: 63mW
R121-R123 = R-0R-63mW-5%-0603: Resistor 0 ohm 63mW 5% 0603; Rating: 63mW; Tolerance: 5%; Value: 0R; Size: 0603 (In)
R138 = R-1MR-63mW-5%-0603: Resistor 1 Mohm 63mW 5% 0603; Value: 1MR; Rating: 63mW; Tolerance: 5%
X1 = CON-Tyco-1473005-1-200-0.6mm: as X1 on sheet Colibri; Manufacturer Part No.: 1473005-1
X15 = CON-Pulse-JX0011D21BNL: RJ45 connector with magentics, 10/100 Base-TX, AutoMDIX, Through Hole; Manufacturer Name: Pulse; No. of ways: 12; Manufacturer Part No.: JX0011D21BNL